# EAGLE board debug_backplane (EAGLE 6.6.0), part 1 of 2
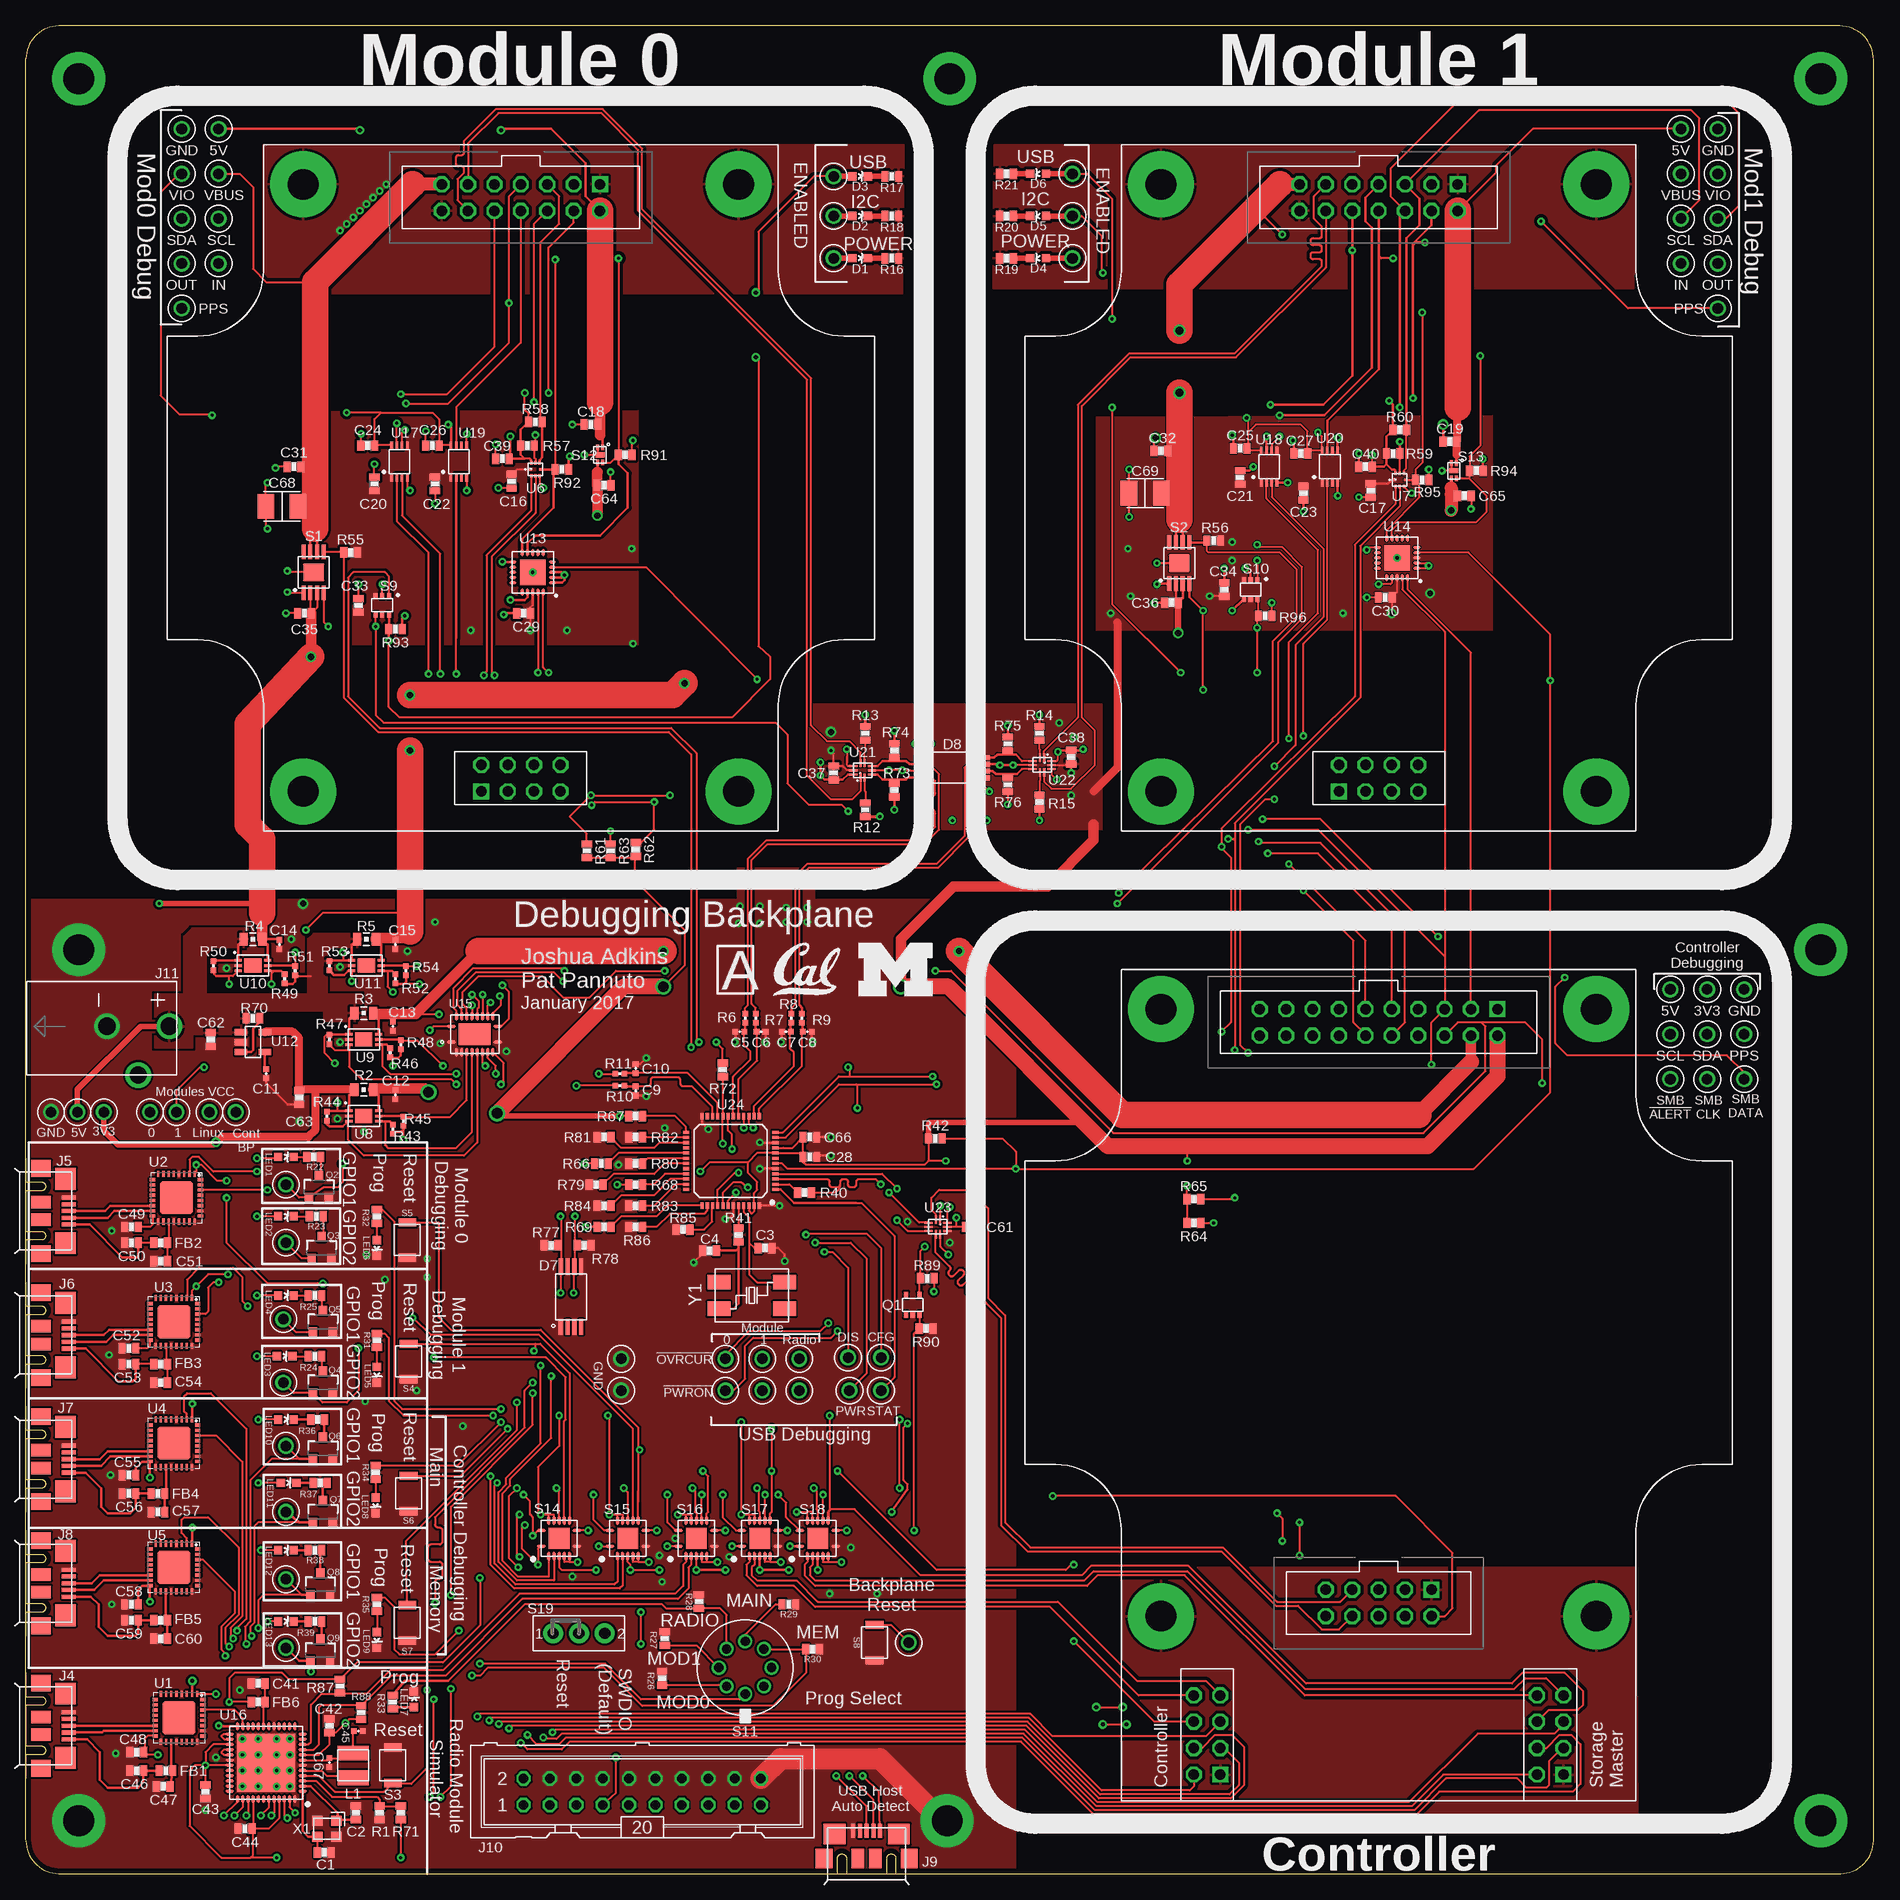
[diagram p15: board, top side]
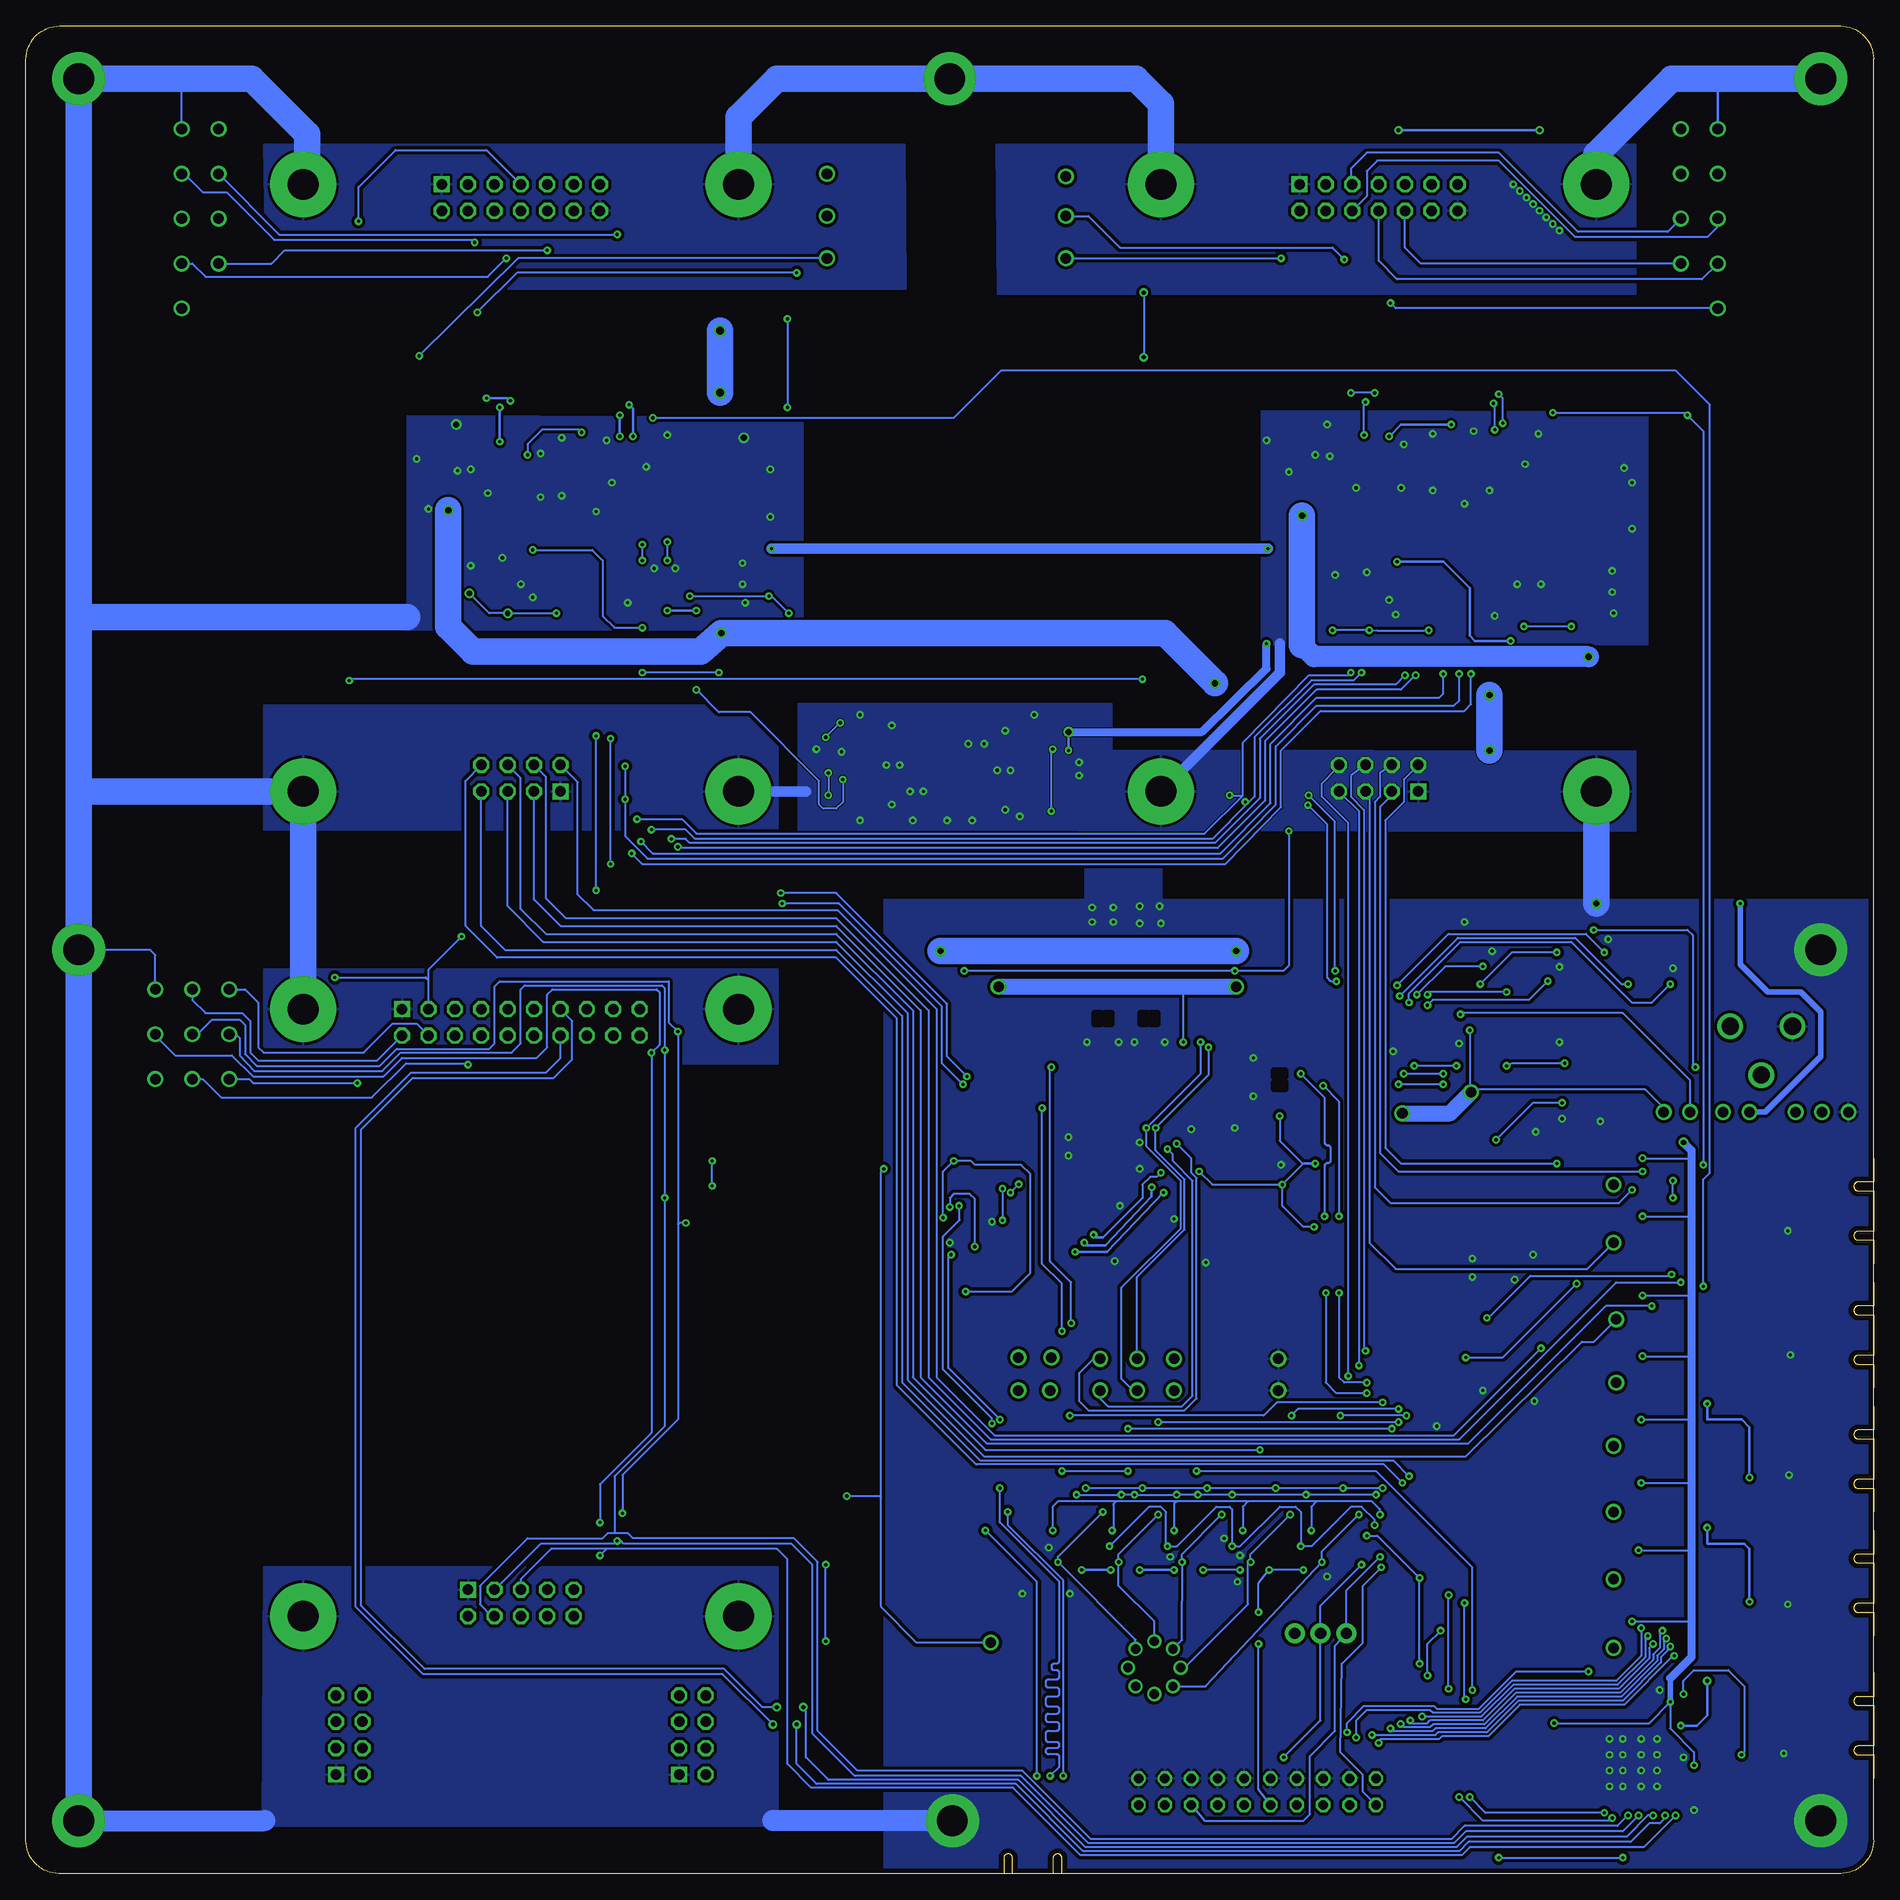
[diagram p16: board, bottom side, seen from below]

Size 177.8 x 177.8 mm. Coordinates in mm from the lower left corner, seen from the top.
Outline: 0,3.17 arc90 3.17,0 174.62,0 arc90 177.8,3.17 177.8,174.56 arc90 174.56,177.8 3.17,177.8 arc90 0,174.62 0,3.24
Copper layers (1*16): Top 0.0178mm / dielectric 59mil / Bottom 0.0178mm
Design rules "quickturn_co_kr_1oz": minimum track width 4mil, minimum drill 0.200659375mm, track to track 4mil, track to pad 4mil, pad to pad 4mil, via to via 4mil, smd to smd 4mil, copper to edge 20mil, drill to drill 16mil, minimum pad ring 8mil, minimum via ring 8mil, stop-mask expansion 3mil, vias tented up to drill 50mil, thermal gap 10mil
tRestrict: area 71.9,69.5 to 72.3,69.6; area 69.8,64.1 to 69.9,64.4

## Footprints (pad centres in the part's own frame; a part is rotated, then mirrored left to right if it is on the bottom)
0603_CAP = smd 0.7 x 1: 1 -0.65,0; 2 0.65,0
0402_CAP = smd 0.536 x 0.546: 1 -0.433,0; 2 0.433,0
1210_CAP = smd 2.4 x 1.6: 1 0,1.55; 2 0,-1.55
LED-0603 = smd 0.8 x 0.8: A 0,-0.75; C 0,0.75
TSSOP-8 = smd 1.5 x 0.45: 1 -2.9,0.975; 2 -2.9,0.325; 3 -2.9,-0.325; 4 -2.9,-0.975; 5 2.9,-0.975; 6 2.9,-0.325; 7 2.9,0.325; 8 2.9,0.975
BACKPLANE_MODULE_20PIN_10PIN_DEBUG = drill 1.016 square: 1 11.43,29.21; 21 5.08,-26.67; 100 -15.24,-44.45; 200 17.78,-44.45 | drill 1.016 octagon: 2 11.43,26.67; 3 8.89,29.21; 4 8.89,26.67; 5 6.35,29.21; 6 6.35,26.67; 7 3.81,29.21; 8 3.81,26.67; 9 1.27,29.21; 10 1.27,26.67; 11 -1.27,29.21; 12 -1.27,26.67; 13 -3.81,29.21; 14 -3.81,26.67; 15 -6.35,29.21; 16 -6.35,26.67; 17 -8.89,29.21; 18 -8.89,26.67; 19 -11.43,29.21; 20 -11.43,26.67; 22 5.08,-29.21; 23 2.54,-26.67; 24 2.54,-29.21; 25 0,-26.67; 26 0,-29.21; 27 -2.54,-26.67; 28 -2.54,-29.21; 29 -5.08,-26.67; 30 -5.08,-29.21; 101 -17.78,-44.45; 102 -15.24,-41.91; 103 -17.78,-41.91; 104 -15.24,-39.37; 105 -17.78,-39.37; 106 -15.24,-36.83; 107 -17.78,-36.83; 201 15.24,-44.45; 202 17.78,-41.91; 203 15.24,-41.91; 204 17.78,-39.37; 205 15.24,-39.37; 206 17.78,-36.83; 207 15.24,-36.83 | drill 2.946 pad 6.35: MNT1 -20.955,29.21; MNT2 20.955,29.21; MNT3 -20.955,-29.21; MNT4 20.955,-29.21
BACKPLANE_MODULE_14PIN_8PIN = drill 1.016 square: 1 7.62,29.21; 15 -3.81,-29.21 | drill 1.016 octagon: 2 7.62,26.67; 3 5.08,29.21; 4 5.08,26.67; 5 2.54,29.21; 6 2.54,26.67; 7 0,29.21; 8 0,26.67; 9 -2.54,29.21; 10 -2.54,26.67; 11 -5.08,29.21; 12 -5.08,26.67; 13 -7.62,29.21; 14 -7.62,26.67; 16 -3.81,-26.67; 17 -1.27,-29.21; 18 -1.27,-26.67; 19 1.27,-29.21; 20 1.27,-26.67; 21 3.81,-29.21; 22 3.81,-26.67 | drill 2.946 pad 6.35: MNT1 -20.955,29.21; MNT2 20.955,29.21; MNT3 20.955,-29.21; MNT4 -20.955,-29.21
USB_MICRO_B-HIROSE-ZX62R-B-5P = smd 0.4 x 1.35: 1 1.3,4.125; 2 0.65,4.125; 3 0,4.125; 4 -0.65,4.125; 5 -1.3,4.125 | smd 2.1 x 2: P$1 3.1,3.8; P$2 -3.1,3.8 | smd 1.6 x 1.9: P$3 -4.1,1.45; P$6 4.1,1.45 | smd 1.2 x 1.9: P$4 -0.85,1.45; P$5 0.85,1.45
ML20 = drill 0.914 octagon: 1 -11.43,-1.27; 2 -11.43,1.27; 3 -8.89,-1.27; 4 -8.89,1.27; 5 -6.35,-1.27; 6 -6.35,1.27; 7 -3.81,-1.27; 8 -3.81,1.27; 9 -1.27,-1.27; 10 -1.27,1.27; 11 1.27,-1.27; 12 1.27,1.27; 13 3.81,-1.27; 14 3.81,1.27; 15 6.35,-1.27; 16 6.35,1.27; 17 8.89,-1.27; 18 8.89,1.27; 19 11.43,-1.27; 20 11.43,1.27
PJ-102AH = drill 1.65: 1 0,-3; 2 0,3; 3 -4.7,0
1212 = smd 1.4 x 3: P$1 -1.2,0; P$2 1.2,0
SOT353 = smd 0.42 x 0.6: D1 0.65,-0.95; D2 -0.65,-0.95; G1 0.65,0.95; G2 -0.65,0.95; S 0,0.95
SOT23-3 = smd 0.8 x 0.9: 1 -0.95,-1; 2 0.95,-1; 3 0,1.1
0603-RES = smd 0.7 x 1: 1 -0.65,0; 2 0.65,0
0805_RES = smd 0.8 x 1.2: 1 -0.9,0; 2 0.9,0
0402_RES-HIGH_SPEED = smd 0.536 x 0.546: 1 -0.433,0; 2 0.433,0
0402_RES = smd 0.536 x 0.546: 1 -0.433,0; 2 0.433,0
MSOP-8EP = smd 0.45 x 1.35: 1 -0.975,-1.975; 2 -0.325,-1.975; 3 0.325,-1.975; 4 0.975,-1.975; 5 0.975,1.975; 6 0.325,1.975; 7 -0.325,1.975; 8 -0.975,1.975 | smd 2 x 1.7: PAD 0,0
B3U-1000P = smd 0.8 x 1.7: 1 -1.7,0; 2 1.7,0
SC70-6 = smd 0.4 x 0.5: 1 -0.65,-0.95; 2 0,-0.95; 3 0.65,-0.95; 4 0.65,0.95; 5 0,0.95; 6 -0.65,0.95
RM-SWITCH = drill 0.9: 1 1.796,1.796; 2 2.54,0; 3 1.796,-1.796; 4 0,-2.54; 5 -1.796,-1.796; 6 -2.54,0; 7 -1.796,1.796; C 0,2.54
TDFN4 = smd 0.3 x 0.55: 1 -0.25,-0.725; 2 0.25,-0.725; 3 0.25,0.725; 4 -0.25,0.725 | smd 0.86 x 0.5: PAD 0,0
S-PVQFN-N14-3.5MM = smd 0.85 x 0.28: 1 -1.725,-0.75; 7 1.725,-0.75; 8 1.725,0.75; 14 -1.725,0.75 | smd 0.28 x 0.85: 2 -1,-1.725; 3 -0.5,-1.725; 4 0,-1.725; 5 0.5,-1.725; 6 1,-1.725; 9 1,1.725; 10 0.5,1.725; 11 0,1.725; 12 -0.5,1.725; 13 -1,1.725 | smd 2 x 2: PAD 0,0
TE_SSA12/SPDT = drill 1.092 pad 1.93: 1 -2.489,0; 2 2.489,0; IN 0,0
TESTPOINT_0.040IN = drill 1.016: TESTPOINT 0,0
QFN32 = smd 0.6 x 0.3: 1 -2.3,1.75; 2 -2.3,1.25; 3 -2.3,0.75; 4 -2.3,0.25; 5 -2.3,-0.25; 6 -2.3,-0.75; 7 -2.3,-1.25; 8 -2.3,-1.75; 17 2.3,-1.75; 18 2.3,-1.25; 19 2.3,-0.75; 20 2.3,-0.25; 21 2.3,0.25; 22 2.3,0.75; 23 2.3,1.25; 24 2.3,1.75 | smd 0.3 x 0.6: 9 -1.75,-2.3; 10 -1.25,-2.3; 11 -0.75,-2.3; 12 -0.25,-2.3; 13 0.25,-2.3; 14 0.75,-2.3; 15 1.25,-2.3; 16 1.75,-2.3; 25 1.75,2.3; 26 1.25,2.3; 27 0.75,2.3; 28 0.25,2.3; 29 -0.25,2.3; 30 -0.75,2.3; 31 -1.25,2.3; 32 -1.75,2.3 | smd 3.2 x 3.2: EXP 0,0
UMLP-8 = smd 0.35 x 0.25: 1 -0.55,0; 5 0.55,0 | smd 0.24 x 0.35: 2 -0.4,-0.625; 3 0,-0.625; 4 0.4,-0.625; 6 0.4,0.625; 7 0,0.625; 8 -0.4,0.625
DFN-6-2MMX3MM = smd 0.25 x 0.7: 1 -0.5,-1.425; 2 0,-1.425; 3 0.5,-1.425; 4 0.5,1.425; 5 0,1.425; 6 -0.5,1.425 | smd 1.35 x 1.65: NC 0,0
SOT-23-5 = smd 0.6 x 1.2: 1 -0.95,-1.15; 2 0,-1.15; 3 0.95,-1.15; 4 0.95,1.15; 5 -0.95,1.15
QFN-20-4MM = smd 0.7 x 0.3: 1 -1.9,1; 2 -1.9,0.5; 3 -1.9,0; 4 -1.9,-0.5; 5 -1.9,-1; 11 1.9,-1; 12 1.9,-0.5; 13 1.9,0; 14 1.9,0.5; 15 1.9,1 | smd 0.3 x 0.7: 6 -1,-1.9; 7 -0.5,-1.9; 8 0,-1.9; 9 0.5,-1.9; 10 1,-1.9; 16 1,1.9; 17 0.5,1.9; 18 0,1.9; 19 -0.5,1.9; 20 -1,1.9 | smd 2.45 x 2.45: GND 0,0
QFN-N20 = smd 0.85 x 0.28: 1 -2.23,-0.75; 10 2.23,-0.75; 11 2.23,0.75; 20 -2.23,0.75 | smd 0.28 x 0.85: 2 -1.75,-1.73; 3 -1.25,-1.73; 4 -0.75,-1.73; 5 -0.25,-1.73; 6 0.25,-1.73; 7 0.75,-1.73; 8 1.25,-1.73; 9 1.75,-1.73; 12 1.75,1.73; 13 1.25,1.73; 14 0.75,1.73; 15 0.25,1.73; 16 -0.25,1.73; 17 -0.75,1.73; 18 -1.25,1.73; 19 -1.75,1.73 | smd 3.05 x 2.05: P$22 0,0
QFN-48-7MM = smd 0.8 x 0.28: 1 -3.5,2.75; 2 -3.5,2.25; 3 -3.5,1.75; 4 -3.5,1.25; 5 -3.5,0.75; 6 -3.5,0.25; 7 -3.5,-0.25; 8 -3.5,-0.75; 9 -3.5,-1.25; 10 -3.5,-1.75; 11 -3.5,-2.25; 12 -3.5,-2.75; 25 3.5,-2.75; 26 3.5,-2.25; 27 3.5,-1.75; 28 3.5,-1.25; 29 3.5,-0.75; 30 3.5,-0.25; 31 3.5,0.25; 32 3.5,0.75; 33 3.5,1.25; 34 3.5,1.75; 35 3.5,2.25; 36 3.5,2.75 | smd 0.28 x 0.8: 13 -2.75,-3.5; 14 -2.25,-3.5; 15 -1.75,-3.5; 16 -1.25,-3.5; 17 -0.75,-3.5; 18 -0.25,-3.5; 19 0.25,-3.5; 20 0.75,-3.5; 21 1.25,-3.5; 22 1.75,-3.5; 23 2.25,-3.5; 24 2.75,-3.5; 37 2.75,3.5; 38 2.25,3.5; 39 1.75,3.5; 40 1.25,3.5; 41 0.75,3.5; 42 0.25,3.5; 43 -0.25,3.5; 44 -0.75,3.5; 45 -1.25,3.5; 46 -1.75,3.5; 47 -2.25,3.5; 48 -2.75,3.5 | smd 5.6 x 5.6: THERMAL 0,0
VFSOP-8 = smd 0.25 x 0.75: 1 -0.75,-1.55; 2 -0.25,-1.55; 3 0.25,-1.55; 4 0.75,-1.55; 5 0.75,1.55; 6 0.25,1.55; 7 -0.25,1.55; 8 -0.75,1.55
UQFN-10 = smd 0.2 x 0.9: 1 -0.2,-0.65 | smd 0.2 x 0.8: 2 0.2,-0.7; 6 0.2,0.7; 7 -0.2,0.7 | smd 0.8 x 0.2: 3 0.9,-0.4; 4 0.9,0; 5 0.9,0.4; 8 -0.9,0.4; 9 -0.9,0; 10 -0.9,-0.4
LQFP-48 = smd 0.3 x 0.6: 1 -2.75,-4.3; 2 -2.25,-4.3; 3 -1.75,-4.3; 4 -1.25,-4.3; 5 -0.75,-4.3; 6 -0.25,-4.3; 7 0.25,-4.3; 8 0.75,-4.3; 9 1.25,-4.3; 10 1.75,-4.3; 11 2.25,-4.3; 12 2.75,-4.3; 25 2.75,4.3; 26 2.25,4.3; 27 1.75,4.3; 28 1.25,4.3; 29 0.75,4.3; 30 0.25,4.3; 31 -0.25,4.3; 32 -0.75,4.3; 33 -1.25,4.3; 34 -1.75,4.3; 35 -2.25,4.3; 36 -2.75,4.3 | smd 0.6 x 0.3: 13 4.3,-2.75; 14 4.3,-2.25; 15 4.3,-1.75; 16 4.3,-1.25; 17 4.3,-0.75; 18 4.3,-0.25; 19 4.3,0.25; 20 4.3,0.75; 21 4.3,1.25; 22 4.3,1.75; 23 4.3,2.25; 24 4.3,2.75; 37 -4.3,2.75; 38 -4.3,2.25; 39 -4.3,1.75; 40 -4.3,1.25; 41 -4.3,0.75; 42 -4.3,0.25; 43 -4.3,-0.25; 44 -4.3,-0.75; 45 -4.3,-1.25; 46 -4.3,-1.75; 47 -4.3,-2.25; 48 -4.3,-2.75
FHXXX = smd 1 x 0.95: 1 -0.925,-0.775; 2 0.925,-0.775; 3 0.925,0.775; 4 -0.925,0.775
ABMM = smd 2.21 x 1.397: 1 -3.167,-1.27; 3 3.15,1.27; NC1 -3.15,1.27; NC2 3.15,-1.27

## Placement (x,y rotation side)
C1  8pF  [0603_CAP]  28.7,2.03 0 top
C2  8pF  [0603_CAP]  31.75,5.84 90 top
C3  22pF  [0603_CAP]  71.12,60.2 180 top
C4  22pF  [0603_CAP]  65.79,59.94 0 top
C5  22pF  [0402_CAP]  68.71,81.03 180 top
C6  22pF  [0402_CAP]  70.74,81.03 0 top
C7  22pF  [0402_CAP]  73.15,81.03 180 top
C8  22pF  [0402_CAP]  75.18,81.03 0 top
C9  22pF  [0402_CAP]  58.67,75.31 270 top
C10  22pF  [0402_CAP]  58.67,77.47 90 top
C11  0.01uF  [0402_CAP]  23.11,76.96 270 top
C12  0.1uF  [0402_CAP]  35.56,74.93 270 top
C13  0.1uF  [0402_CAP]  35.31,81.53 270 top
C14  0.1uF  [0402_CAP]  24.38,89.41 270 top
C15  0.1uF  [0402_CAP]  35.56,89.41 270 top
C16  100nF  [0603_CAP]  46.74,133.99 270 top
C17  100nF  [0603_CAP]  129.41,133.1 270 top
C18  100nF  [0603_CAP]  54.36,139.45 180 top
C19  100nF  [0603_CAP]  137.03,137.79 180 top
C20  100nF  [0603_CAP]  33.53,133.73 90 top
C21  100nF  [0603_CAP]  116.84,134.37 90 top
C22  100nF  [0603_CAP]  39.37,133.73 270 top
C23  100nF  [0603_CAP]  122.94,132.84 270 top
C24  100nF  [0603_CAP]  32.89,137.41 180 top
C25  100nF  [0603_CAP]  116.84,137.16 180 top
C26  100nF  [0603_CAP]  39.12,137.41 180 top
C27  100nF  [0603_CAP]  122.68,136.65 180 top
C28  100nF  [0603_CAP]  75.44,68.96 180 top
C29  100nF  [0603_CAP]  47.88,121.28 180 top
C30  100nF  [0603_CAP]  130.81,122.81 180 top
C31  100nF  [0603_CAP]  25.78,135.38 180 top
C32  100nF  [0603_CAP]  109.22,136.91 180 top
C33  100nF  [0603_CAP]  32,122.05 90 top
C34  100nF  [0603_CAP]  115.32,123.57 90 top
C35  100nF  [0603_CAP]  26.8,121.28 180 top
C36  100nF  [0603_CAP]  110.24,122.3 180 top
C37  100nF  [0603_CAP]  77.72,105.92 90 top
C38  100nF  [0603_CAP]  100.58,107.44 270 top
C39  100nF  [0603_CAP]  45.85,136.14 180 top
C40  100nF  [0603_CAP]  128.91,135.38 180 top
C41  100nF  [0603_CAP]  22.35,18.29 180 top
C42  100nF  [0603_CAP]  29.21,14.22 90 top
C43  100nF  [0603_CAP]  17.27,7.87 270 top
C44  100nF  [0603_CAP]  21.08,4.32 180 top
C45  100nF  [0402_CAP]  32,13.72 0 top
C46  100nF  [0603_CAP]  10.67,9.91 180 top
C47  100nF  [0603_CAP]  13.21,8.38 180 top
C48  100nF  [0603_CAP]  10.67,11.68 180 top
C49  100nF  [0603_CAP]  10.16,62.23 180 top
C50  100nF  [0603_CAP]  10.16,60.71 180 top
C51  100nF  [0603_CAP]  12.95,58.93 180 top
C52  100nF  [0603_CAP]  9.91,50.55 180 top
C53  100nF  [0603_CAP]  9.91,49.02 180 top
C54  100nF  [0603_CAP]  12.95,47.24 180 top
C55  100nF  [0603_CAP]  9.91,38.35 180 top
C56  100nF  [0603_CAP]  9.91,36.58 180 top
C57  100nF  [0603_CAP]  12.7,34.8 180 top
C58  100nF  [0603_CAP]  10.16,25.91 180 top
C59  100nF  [0603_CAP]  10.16,24.38 180 top
C60  100nF  [0603_CAP]  12.95,22.61 180 top
C61  100nF  [0603_CAP]  91.06,62.23 180 top
C62  2.2uF  [0603_CAP]  17.78,80.26 270 top
C63  2.2uF  [0603_CAP]  26.29,74.68 270 top
C64  4.7uF  [0603_CAP]  55.63,133.6 0 top
C65  4.7uF  [0603_CAP]  138.43,132.59 0 top
C66  4.7uF  [0603_CAP]  75.44,70.87 180 top
C67  4.7uF  [0402_CAP]  29.21,10.67 270 top
C68  150uF  [1210_CAP]  24.64,131.57 270 top
C69  150uF  [1210_CAP]  107.7,132.84 270 top
D1  LED0603  [LED-0603]  80.26,155.45 270 top
D2  LED0603  [LED-0603]  80.26,159.51 270 top
D3  LED0603  [LED-0603]  80.26,163.32 270 top
D4  LED0603  [LED-0603]  97.41,155.45 90 top
D5  LED0603  [LED-0603]  97.41,159.51 90 top
D6  LED0603  [LED-0603]  97.41,163.58 90 top
D7  SN75240-TSSOP  [TSSOP-8]  52.45,55.5 90 top
D8  SN75240-TSSOP  [TSSOP-8]  89.15,106.43 0 top
FB1  600R  [0603_CAP]  13.46,9.91 180 top
FB2  600R  [0603_CAP]  12.95,60.71 0 top
FB3  600R  [0603_CAP]  12.95,49.02 0 top
FB4  600R  [0603_CAP]  12.7,36.58 0 top
FB5  600R  [0603_CAP]  12.95,24.38 0 top
FB6  1.5kR  [0603_CAP]  22.35,16.51 180 top
J1  BACKPLANE_CONTROLLER_MODULE_DEBUG  [BACKPLANE_MODULE_20PIN_10PIN_DEBUG]  130.18,53.98 0 top
J2  BACKPLANE_GENERIC_MODULE_DEBUG  [BACKPLANE_MODULE_14PIN_8PIN]  130.18,133.35 0 top
J3  BACKPLANE_GENERIC_MODULE_DEBUG  [BACKPLANE_MODULE_14PIN_8PIN]  47.62,133.35 0 top
J4  MICRO_USB_B_HIROSE_ZX62R-B-5P  [USB_MICRO_B-HIROSE-ZX62R-B-5P]  0,14.22 270 top
J5  MICRO_USB_B_HIROSE_ZX62R-B-5P  [USB_MICRO_B-HIROSE-ZX62R-B-5P]  0,63.75 270 top
J6  MICRO_USB_B_HIROSE_ZX62R-B-5P  [USB_MICRO_B-HIROSE-ZX62R-B-5P]  0,51.82 270 top
J7  MICRO_USB_B_HIROSE_ZX62R-B-5P  [USB_MICRO_B-HIROSE-ZX62R-B-5P]  0,39.88 270 top
J8  MICRO_USB_B_HIROSE_ZX62R-B-5P  [USB_MICRO_B-HIROSE-ZX62R-B-5P]  0,27.94 270 top
J9  MICRO_USB_B_HIROSE_ZX62R-B-5P  [USB_MICRO_B-HIROSE-ZX62R-B-5P]  80.9,0 0 top
J10  [ML20]  59.31,7.87 0 top
J11  PJ-102AH  [PJ-102AH]  10.79,81.53 90 top
L1  22uH  [1212]  31.5,10.41 270 top
LED1  LED0603  [LED-0603]  25.02,68.96 270 top
LED2  LED0603  [LED-0603]  25.02,63.25 270 top
LED3  LED0603  [LED-0603]  24.89,49.78 270 top
LED4  LED0603  [LED-0603]  25.02,55.63 270 top
LED5  LED0603  [LED-0603]  33.78,48.01 180 top
LED6  LED0603  [LED-0603]  33.78,60.2 180 top
LED7  LED0603  [LED-0603]  37.34,16.76 0 top
LED8  LED0603  [LED-0603]  33.66,35.43 180 top
LED9  LED0603  [LED-0603]  33.78,22.48 180 top
LED10  LED0603  [LED-0603]  25.02,43.69 270 top
LED11  LED0603  [LED-0603]  25.27,37.59 270 top
LED12  LED0603  [LED-0603]  25.02,31.11 270 top
LED13  LED0603  [LED-0603]  25.02,24.26 270 top
Q1  DMN32D2LDF  [SOT353]  85.34,54.74 180 top
Q2  MOSFET-NCHANNELSMD  [SOT23-3]  28.19,66.04 0 top
Q3  MOSFET-NCHANNELSMD  [SOT23-3]  28.45,60.2 0 top
Q4  MOSFET-NCHANNELSMD  [SOT23-3]  28.57,47.24 0 top
Q5  MOSFET-NCHANNELSMD  [SOT23-3]  28.57,53.09 0 top
Q6  MOSFET-NCHANNELSMD  [SOT23-3]  28.57,40.89 0 top
Q7  MOSFET-NCHANNELSMD  [SOT23-3]  28.57,34.8 0 top
Q8  MOSFET-NCHANNELSMD  [SOT23-3]  28.32,27.81 0 top
Q9  MOSFET-NCHANNELSMD  [SOT23-3]  28.32,21.46 0 top
R1  0Ω  [0603-RES]  34.04,5.84 90 top
R2  0.017Ω  [0805_RES]  32.51,75.44 180 top
R3  0.017Ω  [0805_RES]  32.51,82.8 180 top
R4  0.017Ω  [0805_RES]  21.84,89.92 180 top
R5  0.017Ω  [0805_RES]  32.77,89.92 180 top
R6  27Ω  [0402_RES-HIGH_SPEED]  69.22,82.3 270 top
R7  27Ω  [0402_RES-HIGH_SPEED]  70.23,82.3 270 top
R8  27Ω  [0402_RES-HIGH_SPEED]  73.66,82.3 270 top
R9  27Ω  [0402_RES-HIGH_SPEED]  74.68,82.3 270 top
R10  27Ω  [0402_RES-HIGH_SPEED]  57.15,75.82 0 top
R11  27Ω  [0402_RES-HIGH_SPEED]  57.15,76.96 0 top
R12  50Ω  [0603-RES]  80.77,102.36 270 top
R13  50Ω  [0603-RES]  80.77,109.73 90 top
R14  50Ω  [0603-RES]  97.54,109.73 90 top
R15  50Ω  [0603-RES]  97.54,103.12 270 top
R16  1kΩ  [0603-RES]  83.31,155.45 180 top
R17  1kΩ  [0603-RES]  83.31,163.32 180 top
R18  1kΩ  [0603-RES]  83.31,159.51 180 top
R19  1kΩ  [0603-RES]  94.36,155.45 0 top
R20  1kΩ  [0603-RES]  94.36,159.51 0 top
R21  1kΩ  [0603-RES]  94.36,163.58 0 top
R22  1kΩ  [0603-RES]  27.69,68.96 180 top
R23  1kΩ  [0603-RES]  27.94,63.25 180 top
R24  1kΩ  [0603-RES]  27.81,49.78 180 top
R25  1kΩ  [0603-RES]  27.81,55.63 180 top
R26  1kΩ  [0603-RES]  61.21,18.8 270 top
R27  1kΩ  [0603-RES]  61.47,22.61 270 top
R28  1kΩ  [0603-RES]  64.77,26.16 270 top
R29  1kΩ  [0603-RES]  73.41,25.91 180 top
R30  1kΩ  [0603-RES]  75.69,21.59 180 top
R31  1kΩ  [0603-RES]  33.78,51.31 90 top
R32  1kΩ  [0603-RES]  33.78,63.25 90 top
R33  1kΩ  [0603-RES]  35.31,16.51 90 top
R34  1kΩ  [0603-RES]  33.66,38.61 90 top
R35  1kΩ  [0603-RES]  33.78,25.91 90 top
R36  1kΩ  [0603-RES]  28.07,43.69 180 top
R37  1kΩ  [0603-RES]  28.32,37.59 180 top
R38  1kΩ  [0603-RES]  27.81,31.11 180 top
R39  1kΩ  [0603-RES]  27.81,24.26 180 top
R40  1.5kΩ  [0603-RES]  74.93,65.53 180 top
R41  1.5kΩ  [0603-RES]  68.58,61.47 90 top
R42  1.5kΩ  [0603-RES]  87.5,70.74 0 top
R43  2kΩ  [0402_RES]  35.31,71.63 270 top
R44  2kΩ  [0402_RES]  28.96,72.9 90 top
R45  2kΩ  [0402_RES]  36.32,72.39 270 top
R46  2kΩ  [0402_RES]  35.05,78.99 270 top
R47  2kΩ  [0402_RES]  29.21,80.26 90 top
R48  2kΩ  [0402_RES]  36.07,79.76 270 top
R49  2kΩ  [0402_RES]  24.89,86.11 270 top
R50  2kΩ  [0402_RES]  18.03,87.38 90 top
R51  2kΩ  [0402_RES]  25.91,86.87 270 top
R52  2kΩ  [0402_RES]  35.56,86.11 270 top
R53  2kΩ  [0402_RES]  29.21,87.38 90 top
R54  2kΩ  [0402_RES]  36.58,86.87 270 top
R55  10kΩ  [0603-RES]  31.24,127.13 0 top
R56  10kΩ  [0603-RES]  114.3,128.27 0 top
R57  10kΩ  [0603-RES]  48.26,137.41 0 top
R58  10kΩ  [0603-RES]  49.02,139.7 0 top
R59  10kΩ  [0603-RES]  131.57,136.65 0 top
R60  10kΩ  [0603-RES]  132.21,138.94 0 top
R61  10kΩ  [0603-RES]  53.98,98.42 270 top
R62  10kΩ  [0603-RES]  58.67,98.55 270 top
R63  10kΩ  [0603-RES]  56.26,98.42 270 top
R64  10kΩ  [0603-RES]  112.39,62.61 180 top
R65  10kΩ  [0603-RES]  112.39,64.9 180 top
R66  10kΩ  [0603-RES]  55.37,68.33 180 top
R67  10kΩ  [0603-RES]  58.67,72.9 180 top
R68  10kΩ  [0603-RES]  58.67,66.29 180 top
R69  10kΩ  [0603-RES]  55.63,62.23 180 top
R70  10kΩ  [0603-RES]  21.84,82.3 180 top
R71  10kΩ  [0603-RES]  36.07,5.84 270 top
R72  10kΩ  [0603-RES]  67.06,77.34 90 top
R73  15kΩ  [0603-RES]  83.57,104.27 90 top
R74  15kΩ  [0603-RES]  83.57,108.08 270 top
R75  15kΩ  [0603-RES]  94.49,108.71 270 top
R76  15kΩ  [0603-RES]  94.49,104.78 90 top
R77  15kΩ  [0603-RES]  50.55,60.45 0 top
R78  15kΩ  [0603-RES]  53.72,60.45 180 top
R79  15kΩ  [0603-RES]  54.86,66.29 180 top
R80  15kΩ  [0603-RES]  58.67,68.33 180 top
R81  15kΩ  [0603-RES]  55.63,70.87 180 top
R82  15kΩ  [0603-RES]  58.67,70.87 180 top
R83  15kΩ  [0603-RES]  58.67,64.26 180 top
R84  15kΩ  [0603-RES]  55.63,64.26 180 top
R85  15kΩ  [0603-RES]  63.25,61.98 180 top
R86  15kΩ  [0603-RES]  58.67,62.23 180 top
R87  100kΩ  [0603-RES]  30.23,18.03 90 top
R88  100kΩ  [0603-RES]  32.26,15.49 270 top
R89  100kΩ  [0603-RES]  86.74,57.28 0 top
R90  100kΩ  [0603-RES]  86.61,52.45 180 top
R91  10MΩ  [0603-RES]  57.66,136.53 180 top
R92  10MΩ  [0603-RES]  51.56,135.13 180 top
R93  10MΩ  [0603-RES]  35.56,119.76 180 top
R94  10MΩ  [0603-RES]  139.57,135 180 top
R95  10MΩ  [0603-RES]  134.37,134.11 180 top
R96  10MΩ  [0603-RES]  119.25,121.03 180 top
S1  AP2401MP  [MSOP-8EP]  27.69,125.22 0 top
S2  AP2401MP  [MSOP-8EP]  111,126.11 0 top
S3  B3U-1000P  [B3U-1000P]  35.31,10.41 270 top
S4  B3U-1000P  [B3U-1000P]  36.83,49.28 90 top
S5  B3U-1000P  [B3U-1000P]  36.7,60.96 90 top
S6  B3U-1000P  [B3U-1000P]  36.83,36.58 90 top
S7  B3U-1000P  [B3U-1000P]  36.7,24.13 90 top
S8  B3U-1000P  [B3U-1000P]  81.66,22.23 90 top
S9  NC7SZ157  [SC70-6]  34.29,122.05 180 top
S10  NC7SZ157  [SC70-6]  117.86,123.57 180 top
S11  RM106772BCB  [RM-SWITCH]  69.22,19.81 180 top
S12  SIP3240X  [TDFN4]  55.24,136.53 180 top
S13  SIP3240X  [TDFN4]  137.41,135 180 top
S14  SN74AHC4066-RGY  [S-PVQFN-N14-3.5MM]  51.31,32.26 0 top
S15  SN74AHC4066-RGY  [S-PVQFN-N14-3.5MM]  57.91,32.26 0 top
S16  SN74AHC4066-RGY  [S-PVQFN-N14-3.5MM]  64.52,32.26 0 top
S17  SN74AHC4066-RGY  [S-PVQFN-N14-3.5MM]  70.61,32.26 0 top
S18  SN74AHC4066-RGY  [S-PVQFN-N14-3.5MM]  76.2,32.26 0 top
S19  TE_SSA12/SPDT  [TE_SSA12/SPDT]  53.21,23.11 0 top
TP1  TEST_POINT_0.040IN  [TESTPOINT_0.040IN]  165.35,76.45 0 top
TP2  TEST_POINT_0.040IN  [TESTPOINT_0.040IN]  161.8,76.45 0 top
TP3  TEST_POINT_0.040IN  [TESTPOINT_0.040IN]  158.24,76.45 0 top
TP4  TEST_POINT_0.040IN  [TESTPOINT_0.040IN]  4.95,73.28 0 top
TP5  TEST_POINT_0.040IN  [TESTPOINT_0.040IN]  161.8,80.77 0 top
TP6  TEST_POINT_0.040IN  [TESTPOINT_0.040IN]  158.24,80.77 0 top
TP7  TEST_POINT_0.040IN  [TESTPOINT_0.040IN]  7.49,73.28 0 top
TP8  TEST_POINT_0.040IN  [TESTPOINT_0.040IN]  20.19,73.28 0 top
TP9  TEST_POINT_0.040IN  [TESTPOINT_0.040IN]  84.96,22.23 0 top
TP10  TEST_POINT_0.040IN  [TESTPOINT_0.040IN]  165.35,80.77 0 top
TP11  TEST_POINT_0.040IN  [TESTPOINT_0.040IN]  165.35,85.09 0 top
TP12  TEST_POINT_0.040IN  [TESTPOINT_0.040IN]  25.02,41.15 0 top
TP13  TEST_POINT_0.040IN  [TESTPOINT_0.040IN]  25.02,34.8 0 top
TP14  TEST_POINT_0.040IN  [TESTPOINT_0.040IN]  25.02,28.32 0 top
TP15  TEST_POINT_0.040IN  [TESTPOINT_0.040IN]  25.02,21.72 0 top
TP16  TEST_POINT_0.040IN  [TESTPOINT_0.040IN]  11.94,73.28 0 top
TP17  TEST_POINT_0.040IN  [TESTPOINT_0.040IN]  14.48,73.28 0 top
TP18  TEST_POINT_0.040IN  [TESTPOINT_0.040IN]  17.65,73.28 0 top
TP20  TEST_POINT_0.040IN  [TESTPOINT_0.040IN]  18.54,163.58 0 top
TP21  TEST_POINT_0.040IN  [TESTPOINT_0.040IN]  25.02,66.29 0 top
TP23  TEST_POINT_0.040IN  [TESTPOINT_0.040IN]  158.24,85.09 0 top
TP24  TEST_POINT_0.040IN  [TESTPOINT_0.040IN]  161.8,85.09 0 top
TP25  TEST_POINT_0.040IN  [TESTPOINT_0.040IN]  57.28,49.53 0 top
TP27  TEST_POINT_0.040IN  [TESTPOINT_0.040IN]  162.81,167.89 0 top
TP28  TEST_POINT_0.040IN  [TESTPOINT_0.040IN]  82.3,49.66 0 top
TP29  TEST_POINT_0.040IN  [TESTPOINT_0.040IN]  79.25,46.48 0 top
TP30  TEST_POINT_0.040IN  [TESTPOINT_0.040IN]  79.12,49.66 0 top
TP31  TEST_POINT_0.040IN  [TESTPOINT_0.040IN]  82.3,46.48 0 top
TP32  TEST_POINT_0.040IN  [TESTPOINT_0.040IN]  67.31,46.48 0 top
TP33  TEST_POINT_0.040IN  [TESTPOINT_0.040IN]  67.31,49.53 0 top
TP34  TEST_POINT_0.040IN  [TESTPOINT_0.040IN]  70.87,46.48 0 top
TP35  TEST_POINT_0.040IN  [TESTPOINT_0.040IN]  70.87,49.53 0 top
TP36  TEST_POINT_0.040IN  [TESTPOINT_0.040IN]  74.42,46.48 180 top
TP37  TEST_POINT_0.040IN  [TESTPOINT_0.040IN]  74.42,49.53 0 top
TP38  TEST_POINT_0.040IN  [TESTPOINT_0.040IN]  25.02,60.71 0 top
TP39  TEST_POINT_0.040IN  [TESTPOINT_0.040IN]  24.77,47.24 0 top
TP40  TEST_POINT_0.040IN  [TESTPOINT_0.040IN]  24.77,53.34 0 top
TP41  TEST_POINT_0.040IN  [TESTPOINT_0.040IN]  159.26,163.58 0 top
TP42  TEST_POINT_0.040IN  [TESTPOINT_0.040IN]  14.99,159.26 0 top
TP43  TEST_POINT_0.040IN  [TESTPOINT_0.040IN]  18.54,159.26 0 top
TP44  TEST_POINT_0.040IN  [TESTPOINT_0.040IN]  162.81,159.26 0 top
TP45  TEST_POINT_0.040IN  [TESTPOINT_0.040IN]  159.26,159.26 0 top
TP46  TEST_POINT_0.040IN  [TESTPOINT_0.040IN]  14.99,150.62 0 top
TP47  TEST_POINT_0.040IN  [TESTPOINT_0.040IN]  162.81,150.62 0 top
TP48  TEST_POINT_0.040IN  [TESTPOINT_0.040IN]  18.54,154.94 0 top
TP49  TEST_POINT_0.040IN  [TESTPOINT_0.040IN]  14.99,154.94 0 top
TP50  TEST_POINT_0.040IN  [TESTPOINT_0.040IN]  14.99,163.58 0 top
TP51  TEST_POINT_0.040IN  [TESTPOINT_0.040IN]  57.28,46.48 0 top
TP52  TEST_POINT_0.040IN  [TESTPOINT_0.040IN]  159.26,154.94 0 top
TP53  TEST_POINT_0.040IN  [TESTPOINT_0.040IN]  162.81,154.94 0 top
TP54  TEST_POINT_0.040IN  [TESTPOINT_0.040IN]  14.99,167.89 0 top
TP55  TEST_POINT_0.040IN  [TESTPOINT_0.040IN]  162.81,163.58 0 top
TP56  TEST_POINT_0.040IN  [TESTPOINT_0.040IN]  2.41,73.28 0 top
TP57  TEST_POINT_0.040IN  [TESTPOINT_0.040IN]  18.54,167.89 0 top
TP58  TEST_POINT_0.040IN  [TESTPOINT_0.040IN]  159.26,167.89 0 top
TP1001  TEST_POINT_0.040IN  [TESTPOINT_0.040IN]  77.72,155.45 0 top
TP1002  TEST_POINT_0.040IN  [TESTPOINT_0.040IN]  77.72,159.51 0 top
TP1003  TEST_POINT_0.040IN  [TESTPOINT_0.040IN]  77.72,163.32 0 top
TP1004  TEST_POINT_0.040IN  [TESTPOINT_0.040IN]  100.71,155.45 90 top
TP1005  TEST_POINT_0.040IN  [TESTPOINT_0.040IN]  100.71,159.51 90 top
TP1006  TEST_POINT_0.040IN  [TESTPOINT_0.040IN]  100.71,163.58 90 top
U1  FT232RQ  [QFN32]  14.73,14.99 270 top
U2  FT232RQ  [QFN32]  14.48,65.02 270 top
U3  FT232RQ  [QFN32]  14.22,53.09 270 top
U4  FT232RQ  [QFN32]  14.22,41.4 270 top
U5  FT232RQ  [QFN32]  14.22,29.46 270 top
U6  FXMA2102  [UMLP-8]  49.02,135.13 0 top
U7  FXMA2102  [UMLP-8]  132.21,134.11 0 top
U8  LTC2941  [DFN-6-2MMX3MM]  32.51,72.9 270 top
U9  LTC2941  [DFN-6-2MMX3MM]  32.51,80.26 270 top
U10  LTC2941  [DFN-6-2MMX3MM]  21.84,87.38 270 top
U11  LTC2941  [DFN-6-2MMX3MM]  32.77,87.38 270 top
U12  MAX8887EZK33+T  [SOT-23-5]  21.84,80.01 270 top
U13  MCP23008QFN  [QFN-20-4MM]  48.77,125.22 180 top
U14  MCP23008QFN  [QFN-20-4MM]  131.95,126.62 180 top
U15  PCA9544AQFN-N20  [QFN-N20]  43.18,80.77 0 top
U16  SAM4LC8AA  [QFN-48-7MM]  23.11,10.67 180 top
U17  SN74LVC2T45  [VFSOP-8]  35.94,135.89 0 top
U18  SN74LVC2T45  [VFSOP-8]  119.63,135.38 0 top
U19  SN74LVC2T45  [VFSOP-8]  41.66,135.89 0 top
U20  SN74LVC2T45  [VFSOP-8]  125.48,135.38 0 top
U21  TS3USB30E  [UQFN-10]  80.52,106.17 0 top
U22  TS3USB30E  [UQFN-10]  97.79,106.68 180 top
U23  TS3USB30E  [UQFN-10]  87.76,62.23 180 top
U24  TUSB2077A  [LQFP-48]  67.82,68.58 90 top
U$12  [UMICH_SOLID_200MIL]  80.14,84.45 0 top
U$15  [UCB_CAL_200MIL]  71.88,84.45 0 top
X1  16MHz  [FHXXX]  28.96,4.32 180 top
Y1  ABMM  [ABMM]  69.85,55.63 0 top

## Tracks (layer width: path | path; a pad name or v marks a point on that pad's centre or on a via)
3V3  (via drill 0.3, 0.51)
  Top 0.203: U16.40 21.86,4.45 C44.1 | 19.59,12.45 U16.27 18.06,12.42 18.03,12.45 17.27,11.68 v17.27,10.41 | FB6.2 v19.56,16.51 19.56,18.8 20.07,19.3 24.64,19.3 25.26,18.68 R87.2 31.86,20.32 40.13,20.32 43.69,23.88 v43.69,28.45 | U16.8 28.18,11.42 29.21,12.45 C42.1 29.83,13.57 v30.73,14.48 31.1,14.84 R88.2 | U16.45 24.36,5.31 23.37,4.32 C44.1 | LED1.A 24.13,68.83 v22.23,68.83 | LED2.A v22.23,63.25 | LED4.A v22.23,55.63 | LED3.A v22.23,49.78 | LED10.A v22.35,43.69 | LED11.A v22.35,37.59 | LED12.A v22.61,31.11 | LED13.A v23.24,24.26 | 21.59,1.52 18.8,1.52 15.75,4.57 15.75,9.91 16.26,10.41 v17.27,10.41 | 21.59,1.52 21.84,1.78 21.84,4.21 C44.1 | R71.2 v36.07,1.52 | v24.13,1.52 21.59,1.52 | U8.1 29.98,73.4 29.97,73.41 v29.97,74.17 | v36.32,70.61 R45.2 | U16.31 v17.27,10.41 | C43.1 v17.27,10.41 | S14.14 49.26,33.01 v48.77,32.51 48.77,34.29 48.51,34.54 48.51,35.81 v47.88,36.45 | S18.14 74.43,33.01 73.15,34.29 73.15,35.69 v72.39,36.45 | v67.06,36.45 67.06,34.29 68.33,33.02 68.88,33.02 S17.14 | S16.14 62.5,33.01 61.72,33.78 v61.72,36.45 | S15.14 55.64,33.01 54.61,34.04 v54.61,36.45 | v43.69,20.19 55.75,20.19 59.18,16.76 68.71,16.76 S11.C | S16.10 65.02,34.92 65.02,35.18 v65.02,36.45 | S17.10 71.11,35.3 71.12,35.31 v71.12,36.45 | S18.10 v76.7,36.44 v76.71,36.45
  Top 0.254: R44.2 29.02,73.4 U8.1 31.09,74.91 R2.2 | R45.2 36.32,71.63 36.07,71.37 35.38,71.37 R43.2
  Top 0.508: TP7.TESTPOINT 7.49,71.5 8.89,70.1 18.03,70.1 v18.29,70.36
  Top 0.762: R2.2 27.81,75.44 | 27.81,75.44 26.53,75.44 C63.1 26.29,80.39 25.65,81.03 23.06,81.03 U12.5 | 27.81,75.44 27.81,71.5 27.18,70.87 18.8,70.87 v18.29,70.36
  Bottom 0.203: v22.23,68.83 17.78,68.83 17.53,69.09 | v22.23,63.25 17.78,63.25 17.53,63.5 | v22.23,55.63 17.78,55.63 17.53,55.37 | v22.23,49.78 17.53,49.78 | v22.35,43.69 17.53,43.69 | v22.35,37.59 17.53,37.59 | v22.61,31.11 17.53,31.11 | v23.24,24.26 17.78,24.26 17.53,24.64 | v36.07,1.52 v24.13,1.52 | v30.73,14.48 21.59,14.48 v19.56,16.51 19.56,13.97 17.27,11.68 v17.27,10.41 | v29.97,74.17 32.77,74.17 v36.32,70.61 | v48.77,32.51 47.75,32.51 v43.69,28.45 v43.69,20.19 | v47.88,36.45 v54.61,36.45 v61.72,36.45 v65.02,36.45 v67.06,36.45 v71.12,36.45 v72.39,36.45 v76.71,36.45
  Bottom 0.508: v19.56,16.51 19.56,18.8
  Bottom 0.762: v18.29,70.36 17.53,69.6 17.53,69.09 17.53,63.5 17.53,55.37 17.53,49.78 17.53,43.69 17.53,37.59 17.53,31.11 17.53,24.64 17.53,20.83 19.56,18.8
5V  (via drill 0.3)
  Top 0.203: 29.53,80.76 28.95,80.76 28.7,80.52 28.7,78.99 v29.72,77.98 | v35.31,77.72 35.31,78.31 R46.2 | 30.57,87.88 30.57,88.56 v30.48,88.65 | v37.85,85.6 36.07,85.6 | R51.2 25.98,86.36 27.43,86.36
  Top 0.254: R47.2 29.53,80.76 U9.1 31.09,82.28 R3.2 | R48.2 36.07,78.74 35.81,78.49 35.13,78.49 R46.2 | R50.2 18.36,87.88 U10.1 20.42,89.39 R4.2 | R51.2 25.91,85.85 25.65,85.6 24.97,85.6 R49.2 | R53.2 29.4,87.88 30.57,87.88 U11.1 31.34,89.39 R5.2 | R54.2 36.58,85.85 36.32,85.6 36.07,85.6 35.63,85.6 R52.2
  Top 0.508: TP4.TESTPOINT 4.95,75.44 11.05,81.53 J11.1
  Bottom 0.203: v29.72,77.98 34.8,77.98 v35.31,77.72 | v30.48,88.65 34.8,88.65 v37.85,85.6
  pour Top (isolate 0.305): 12.45,79.5 12.45,84.58 21.34,84.58 21.34,80.77 16,80.77 16,79.5
  pour Top (isolate 0.305): 21.34,89.15 18.03,89.15 17.27,88.39 17.27,82.3 15.24,82.3 15.24,90.17 16,90.93 21.34,90.93 21.34,89.41
  pour Top (isolate 0.305): 32.26,89.15 29.46,89.15 28.96,88.65 28.96,83.06 20.83,83.06 20.83,84.58 27.18,84.58 27.18,89.92 27.69,90.42 32.26,90.42
  pour Top (isolate 0.305): 28.7,84.58 32.26,84.58 32.26,82.04 28.7,82.04
!BACKPLANE_RESET  (via drill 0.3)
  Top 0.203: J1.22 136.53,24.77 137.29,25.53 137.29,30.86 131.83,36.32 v98.81,36.32 | v95.25,67.82 73.28,67.82 72.77,68.33 U24.6 | v95.25,67.82 139.32,67.82 146.69,75.18 v146.69,114.81 146.69,119.25 138.81,127.13 U14.4 | U13.4 59.7,125.72 v70.36,114.94 | R42.2 93.98,70.74 95.25,69.47 v95.25,67.82 | S8.2 83.26,23.93 TP9.TESTPOINT
  Bottom 0.203: v70.36,114.94 146.43,114.94 v146.69,114.81 | TP9.TESTPOINT 92.08,22.23 95.5,25.65 95.5,36.32 | 95.5,36.32 95.5,67.56 v95.25,67.82 | v98.81,36.32 95.5,36.32
!SMBALERT  (via drill 0.3)
  Top 0.203: U15.17 42.43,83.3 42.04,83.69 42.04,84.84 43.56,86.36 49.66,86.36 51.69,84.33 54.23,84.33 56.77,86.87 v61.47,86.87 | v87.5,86.87 89.03,86.87 104.65,71.25 134.49,71.25 140.46,77.22 140.46,81.53 140.08,81.92 | 140.08,81.92 137.79,81.92 J1.6 | R63.1 v56.26,100.33 | v145.92,76.07 145.92,80.26 144.27,81.92 140.08,81.92
  Bottom 0.203: v87.5,86.87 v61.47,86.87 56.77,86.87 56.26,87.38 v56.26,100.33 | TP3.TESTPOINT 156.34,76.45 155.96,76.07 v145.92,76.07
CONT0_!RESET  (via drill 0.3)
  Top 0.203: J1.105 108.58,14.61 v100.84,22.35 | v100.84,29.72 100.58,29.72 100.08,29.21 87.63,29.21 v78.11,38.73 | S6.2 41.83,38.28 v46.35,42.8 | v71.75,42.8 v71.75,38.73 71.75,34.8 71.61,34.66 S17.9
  Bottom 0.203: v100.84,22.35 v100.84,29.72 | v46.35,42.8 v71.75,42.8 | v78.11,38.73 v71.75,38.73
CONT0_DBG_GPIO1  (via drill 0.3)
  Top 0.203: Q6.1 23.64,39.89 21.59,37.85 21.59,24.26 21.08,23.75 21.08,22.23 v21.21,22.1 | J1.101 112.39,8.38 112.01,8 103.5,8 96.52,14.99 44.83,14.99 v44.58,14.73
  Top 0.254: TP12.TESTPOINT 26.27,39.89 Q6.1
  Bottom 0.203: v21.21,22.1 21.59,21.72 21.59,20.7 24.51,17.78 34.54,17.78 37.59,14.73 42.67,14.73 42.93,14.48 44.32,14.48 v44.58,14.73
CONT0_DBG_GPIO2  (via drill 0.3)
  Top 0.203: J1.104 113.54,13.21 98.81,13.21 96.65,15.37 43.69,15.37 v43.43,15.11 | Q7.1 22.37,33.8 21.97,33.4 21.97,24.13 21.59,23.75 21.59,22.99 v21.72,22.86
  Top 0.254: Q7.1 26.27,33.8 TP13.TESTPOINT
  Bottom 0.203: v21.72,22.86 21.97,22.61 21.97,20.83 24.64,18.16 34.67,18.16 37.72,15.11 v43.43,15.11
CONT0_DBG_RX  (via drill 0.3)
  Top 0.203: U4.30 16.75,42.15 16.76,42.16 18.29,42.16 20.83,39.62 20.83,24.77 19.68,23.62 19.68,22.86 v19.94,22.61 | J1.103 113.16,12.06 114.43,13.34 116.08,13.34 117.22,12.19 117.22,8.51 115.95,7.24 103.25,7.24 96.27,14.22 46.74,14.22 v46.48,13.97
  Bottom 0.203: v19.94,22.61 20.19,22.35 20.19,21.59 20.83,20.95 20.83,20.45 24.26,17.02 34.29,17.02 37.34,13.97 42.16,13.97 42.42,13.72 46.23,13.72 v46.48,13.97
CONT0_DBG_TX  (via drill 0.3)
  Top 0.203: U4.2 15.47,44.22 15.24,44.45 15.24,45.97 15.49,46.23 17.78,46.23 21.21,42.8 21.21,24.51 20.32,23.62 v20.32,23.37 | J1.102 115.32,12.06 116.71,10.67 116.71,8.51 115.82,7.62 103.38,7.62 96.39,14.61 45.72,14.61 v45.52,14.4
  Bottom 0.203: v20.32,23.37 20.57,23.11 20.57,21.72 21.21,21.08 21.21,20.57 24.38,17.4 34.42,17.4 37.47,14.35 42.42,14.35 42.67,14.1 45.21,14.1 v45.52,14.4
CONT0_SWDCLK
  Top 0.203: S17.3 70.11,29.73 69.85,29.46 69.85,28.7 70.36,28.19 74.17,28.19 76.2,26.16 99.31,26.16 106.93,18.54 113.54,18.54 J1.106
CONT0_SWDIO
  Top 0.203: S17.2 69.61,29.99 69.34,29.72 69.34,28.7 70.36,27.69 73.91,27.69 75.95,25.65 98.55,25.65 107.06,17.14 J1.107
CONT0_VCCIO  (via drill 0.3)
  Top 0.254: C55.1 10.56,39 11.18,39.62 11.9,39.62 U4.16 11.92,38.11 v11.94,38.1 | v16,45.21 16,43.73 U4.1
  Bottom 0.254: v11.94,38.1 11.94,42.93 12.7,43.69 15.96,43.69 U4.1 15.97,45.18 v16,45.21
CONT1_!RESET  (via drill 0.3)
  Top 0.203: J1.205 146.56,15.75 149.35,15.75 149.86,16.26 149.86,17.53 148.08,19.3 144.02,19.3 143,18.29 123.19,18.29 111.89,29.59 102.49,29.59 101.6,28.7 86.11,28.7 79.76,35.05 77.47,35.05 77.2,34.78 S18.9 77.22,34 77.22,34.8 77.34,34.92 v77.34,44.07 | S7.2 36.58,32 47.24,42.67 v47.24,45.34
  Bottom 0.203: v47.24,45.34 57.4,45.34 58.67,44.07 v77.34,44.07
CONT1_DBG_GPIO1  (via drill 0.3)
  Top 0.203: Q8.1 22.88,26.81 22.35,26.29 v22.35,23.62 | J1.201 136.4,9.53 133.35,6.48 103,6.48 96.01,13.46 51.56,13.46 51.05,12.95 49.91,12.95 v49.78,13.08
  Top 0.254: Q8.1 26.53,26.81 TP14.TESTPOINT
  Bottom 0.203: v22.35,23.62 22.35,20.95 24.77,18.54 34.8,18.54 37.85,15.49 42.42,15.49 42.67,15.75 48.77,15.75 49.78,14.73 v49.78,13.08
CONT1_DBG_GPIO2  (via drill 0.3)
  Top 0.203: J1.204 147.96,14.35 147.07,13.46 139.7,13.46 133.1,6.86 103.12,6.86 96.14,13.84 50.93,13.84 v50.67,13.59 | Q9.1 27.37,19.49 v27.43,19.43
  Top 0.254: TP15.TESTPOINT 26.27,20.46 Q9.1
  Bottom 0.203: v27.43,19.43 34.42,19.43 37.97,15.88 42.04,15.88 42.29,16.13 49.02,16.13 50.67,14.48 v50.67,13.59
CONT1_DBG_RX  (via drill 0.3)
  Top 0.203: U5.30 17.03,30.21 20.07,27.18 20.07,25.02 18.8,23.75 18.8,21.59 19.18,21.21 v19.18,20.95 | J1.203 146.3,12.06 147.57,13.34 148.72,13.34 149.61,12.45 149.61,8.64 148.84,7.87 136.02,7.87 133.86,5.71 102.74,5.71 95.76,12.7 52.32,12.7 51.56,11.94 48.26,11.94 v47.62,12.57
  Bottom 0.203: v19.18,20.95 19.3,20.95 24,16.26 34.04,16.26 37.08,13.21 41.53,13.21 41.78,12.95 47.37,12.95 47.62,12.7 v47.62,12.57
CONT1_DBG_TX  (via drill 0.3)
  Top 0.203: U5.2 15.47,32.28 14.99,32.77 14.99,34.04 15.24,34.29 17.53,34.29 20.45,31.37 20.45,24.89 19.18,23.62 19.18,22.23 v19.56,21.84 | J1.202 147.83,12.06 146.56,10.79 146.56,8.51 146.3,8.26 144.4,8.26 143.51,9.14 136.65,9.14 133.6,6.1 102.87,6.1 95.89,13.08 51.94,13.08 51.31,12.45 49.15,12.45 v48.26,13.34
  Bottom 0.203: v19.56,21.84 19.81,21.59 19.81,21.46 20.45,20.83 20.45,20.32 24.13,16.64 34.16,16.64 37.21,13.59 41.91,13.59 42.16,13.34 v48.26,13.34
CONT1_SWDCLK
  Top 0.203: S18.3 75.7,29.73 75.44,29.46 75.44,28.7 75.95,28.19 101.85,28.19 102.74,29.08 111.76,29.08 123.06,17.78 143.26,17.78 144.27,18.8 146.3,18.8 J1.206
CONT1_SWDIO
  Top 0.203: S18.2 75.2,29.99 74.93,29.72 74.93,28.7 75.95,27.69 102.11,27.69 103.12,28.7 111.51,28.7 123.06,17.14 J1.207
CONT1_VCCIO  (via drill 0.3)
  Top 0.254: C58.1 10.81,27.32 11.18,27.69 11.9,27.69 U5.16 11.92,26.18 v11.94,26.16 | v16,33.27 16,31.79 U5.1
  Bottom 0.254: v11.94,26.16 11.94,31.24 12.45,31.75 U5.1 15.97,33.25 v16,33.27
CONT_MOD0_IN  (via drill 0.3)
  Top 0.203: U17.2 35.69,130.17 38.73,127.13 v38.73,115.44 | J1.9 131.44,91.06 124.33,98.17 v119.51,98.17
  Bottom 0.203: v119.51,98.17 118.49,97.16 62.36,97.16 57.02,102.62 57.02,108.08 53.21,111.89 39.37,111.89 38.73,112.52 v38.73,115.44
CONT_MOD0_OUT  (via drill 0.3)
  Top 0.203: J1.10 132.72,81.92 132.72,91.06 124.59,99.19 118.75,99.19 | v41.4,115.44 41.4,118.87
  Top 0.254: U19.2 41.41,119 41.4,118.87 | 118.75,99.19 v118.62,99.31
  Bottom 0.203: v118.62,99.31 117.47,98.17 62.87,98.17 58.04,103 58.04,108.71 53.59,113.16 41.78,113.16 41.4,113.54 v41.4,115.44
CONT_MOD1_IN  (via drill 0.3)
  Top 0.203: J1.11 128.91,89.79 v121.54,97.16 | v121.54,109.22 121.54,118.49 124.33,121.28 124.33,127.38 119.38,132.33 U18.2
  Top 0.254: U18.2
  Bottom 0.203: v121.54,97.16 v121.54,109.22
CONT_MOD1_OUT  (via drill 0.3)
  Top 0.203: J1.12 128.91,80.77 127.76,81.92 127.76,89.79 v122.94,94.61 | v122.94,109.47 122.94,118.36 125.22,120.65 125.22,133.71 U20.2
  Bottom 0.203: v122.94,94.61 v122.94,109.47
CONT_MOD2_IN  (via drill 0.3, 0.41)
  Top 0.203: U16.39 21.36,5.74 v21.21,5.59 | v103,16 v105.54,16
  Bottom 0.203: v21.21,5.59 21.72,5.59 23.75,3.56 39.12,3.56 40.13,2.54 75.82,2.54 82.3,9.02 100.58,9.02 102.74,11.18 102.74,15.75 v103,16 | v105.54,16 106.93,16 110.62,19.68 139.45,19.68 145.54,25.78 145.54,71.63 140.59,76.58 127,76.58 125.22,78.36 125.22,82.04 J1.13
CONT_MOD2_OUT  (via drill 0.3, 0.41)
  Top 0.203: U16.38 20.86,6.39 v20.07,5.59 | v103.63,14.35 v105.92,14.35
  Bottom 0.203: v20.07,5.59 20.07,5.33 20.57,4.83 21.59,4.83 23.37,3.05 38.99,3.05 39.88,2.16 76.07,2.16 82.55,8.64 101.73,8.64 103.63,10.54 v103.63,14.35 | v105.92,14.35 110.74,19.18 139.57,19.18 146.05,25.65 146.05,71.75 140.72,77.09 127.76,77.09 126.36,78.49 J1.14
CONT_USB+
  Top 0.203: U23.2 87.56,63.45 87.12,63.88 87.12,65.02 87.88,65.79 90.81,65.79 92.58,64.01 92.58,55.37 94.23,53.72 94.23,33.78 96.65,31.37 115.19,31.37 120.4,26.16 126.49,26.16 J1.27
CONT_USB-
  Top 0.203: U23.6 87.5,61.48 87.5,59.82 88.88,58.44 arc-90 88.88,58.03 88.85,58 arc90 88.85,57.58 88.88,57.55 arc90 89.3,57.55 89.77,58.02 arc-90 90.18,58.02 90.21,58 arc-90 90.21,57.58 89.74,57.11 arc90 89.74,56.7 89.77,56.67 arc90 90.18,56.67 90.65,57.14 arc-90 91.06,57.14 91.09,57.11 arc-90 91.09,56.7 90.62,56.23 arc90 90.62,55.81 90.65,55.78 arc90 91.06,55.78 91.54,56.26 arc-90 91.95,56.26 91.98,56.23 arc-90 91.98,55.81 91.51,55.34 arc90 91.51,54.93 91.54,54.9 arc90 91.95,54.9 91.98,54.93 arc-90 92.39,54.93 93.85,53.47 93.85,33.53 96.39,30.99 115.06,30.99 120.27,25.78 122.43,25.78 124.71,23.5 126.36,23.5 J1.28
CONTROLLER_BUCK/LDO_N
  Top 0.203: U16.3 27.91,8.92 29.46,7.37 33.78,7.37 34.04,7.11 R1.2 R71.1
CONTROLLER_XIN
  Top 0.203: C1.1 28.05,3.52 X1.3
  Top 0.254: U16.1 26.61,4.12 27.18,3.56 28.02,3.56 X1.3 27.82,3.29
CONTROLLER_XOUT
  Top 0.254: U16.2 27.4,8.42 29.97,5.84 29.97,5.18 | C2.1 29.98,5.19 29.97,5.18 | 29.97,5.18 X1.1
GND  (via drill 0.3, 0.6, 0.61, 2.95 pad 5.08)
  Top 0.203: U21.10 79.1,105.77 | U21.4 v83.06,106.17 v84.33,106.17 85.09,106.17 85.16,106.1 D8.3 | U22.4 v95,106.68 | D8.5 92.05,104.8 | 92.05,104.8 v92.71,104.14 | 92.05,104.8 92.05,104.75 v91.44,104.14 | U22.10 99.21,107.08 99.31,107.19 v99.31,107.95 | U6.4 49.42,133.71 v49.78,133.35 | v67.31,62.99 67.56,62.99 68.07,63.5 U24.43 | C65.2 139.08,131.43 v139.06,131.32 | v136.27,135 S13.PAD 137.16,135.25 S13.2 | U14.17 131.45,124.21 131.32,124.08 v130.18,124.08 | C30.2 v129.03,122.81 | U14.1 134.76,125.62 v135,125.86 134.74,126.12 U14.2 | R96.1 119.9,122.29 v119.89,122.3 | U19.4 42.41,133.11 v42.42,133.1 | U19.5 42.41,138.54 v42.42,138.56 | C26.2 38.47,138.8 v38.48,138.81 | C22.2 v39.37,131.83 | U17.4 36.69,133.36 v36.96,133.1 | C16.2 45.48,133.34 v45.47,133.35 | C39.2 45.2,137.53 v45.21,137.54 | C18.2 v52.58,139.45 | v53.72,136.53 S12.PAD 54.99,136.78 S12.2 | C64.2 56.28,134.86 v56.26,134.87 | R91.1 58.31,137.81 v58.42,137.92 | C20.2 v33.53,135.64 | C24.2 32.24,138.54 v32.26,138.56 | S9.2 v34.29,124.08 | C33.2 v32,124.08 | S1.PAD 25.27,125.22 v25.15,125.35 | S1.1 25.22,123.25 v25.15,123.32 | C35.2 v25.02,121.28 | v23.24,129.41 23.09,129.51 C68.2 23.09,133.76 v23.24,133.86 | C31.2 24.13,135.38 v24,135.25
  Top 0.254: 79.1,105.77 78.6,105.27 C37.1 76.85,105.27 v76.45,105.66 v76.45,106.93 | D8.1 86.25,108.06 | 86.25,108.06 v85.6,108.71 | 86.25,108.06 86.47,108.06 v87.12,108.71 | D8.7 93.66,106.75 v93.73,106.68 v95,106.68 | v99.31,107.95 99.46,108.09 C38.1 101.49,108.09 v101.73,108.2 | C25.2 116.19,138.32 v116.08,138.43 | C23.2 v122.94,131.06 | C27.2 122.03,137.81 v121.92,137.92 | U18.4 121.39,133.83 v121.41,133.86 | U20.4 126.23,132.6 v126.24,132.59 | U20.5 126.23,138.16 v126.24,138.18 | C19.2 136.38,139.46 v136.4,139.45 | R73.1 v83.57,102.36 | R74.1 v83.57,109.98 | R76.1 v94.49,102.87 | R75.1 v94.49,110.49 | C4.1 65.15,59.69 v64.26,58.8 | U24.48 71.61,64.28 v72.52,64.26 | U24.5 70.62,67.83 v70.61,67.82 | U24.10 70.64,70.33 v70.61,70.36 | U24.24 65.07,72.22 v65.66,71.63 | C9.2 59.62,74.88 v59.69,74.8 | C10.2 59.11,77.9 v59.69,78.49 | C5.2 68.27,80.08 v68.2,80.01 | C6.2 71.17,80.06 v71.12,80.01 | C7.2 72.72,80.08 v72.64,80.01 | C8.2 75.62,80.08 v75.69,80.01 | R92.1 52.21,136.29 v52.32,136.4 | C66.1 v77.47,70.87 | C28.1 76.09,68.72 76.45,69.09 v77.47,69.09 | v106.17,130.56 106.15,130.58 C69.2 106.15,135.1 v106.17,135.13 | S10.2 117.86,125.09 v117.35,125.6 | C34.2 v115.32,125.6 | C21.2 117.74,135.02 v118.11,135.38 | U24.43 | C3.1 72.39,60.2 73.03,59.56 v73.03,58.93 | R14.2 v97.54,111.51 | R15.2 v97.54,101.35 | C32.2 108.57,138.03 v108.71,138.18 | C11.2 23.11,76.07 25.16,74.03 C63.2 | C40.2 128.27,135.4 v128.27,136.65 | C17.2 129.4,132.46 v128.27,132.46 | U7.4 133.25,132.84 v133.35,132.84 | R95.1 135,134.13 v135,135.13 | R94.1 140.21,135.02 v140.21,136.14 | C36.2 v108.58,122.3 | S2.1 108.9,124.14 v108.84,124.08 | S2.PAD v108.84,126.11 | U13.2 51.57,124.72 v51.82,124.97
  Top 0.254: U13.3 51.56,125.22 v51.82,124.97 | U13.1 51.58,124.22 51.82,124.46 v51.82,124.97 | C29.2 46.1,121.28 v45.97,121.16 | U13.17 48.27,122.82 48.01,122.56 v46.61,122.56 | R93.1 36.21,120.79 v36.45,121.03
  Top 0.305: R13.2 v80.77,111.51 | R12.2 v82.17,101.73
  Top 2.032: J10.20 72.64,11.05 82.17,11.05 88.14,5.08 v88.65,5.08
  Bottom 0.203: 172.47,59.69 173.35,58.8 173.23,58.8 172.72,59.31 | 172.59,48.39 172.72,48.26 | 172.59,50.04 172.72,49.91 | TP11.TESTPOINT 165.35,88.39 165.86,88.9 v172.72,88.9 | TP27.TESTPOINT 162.81,172.34 162.43,172.72
  Bottom 0.254: TP54.TESTPOINT 14.99,172.72
  Bottom 1.016: 57.15,118.36 57.15,115.57 J3.MNT3 | J2.MNT4 102.74,104.14 | 172.72,81.79 172.72,82.68 172.34,83.06 | 151.26,83.06 J1.MNT2 | 151.13,104.01 J2.MNT3
  Bottom 2.032: v88.65,5.08 105.92,5.08 | v172.72,5.08 154.81,5.08
  Bottom 2.54: J2.MNT2 150.75,162.94 150.75,167.39 156.08,172.72 162.43,172.72 v172.72,172.72 172.72,120.9 | J2.MNT1 109.22,169.04 105.54,172.72 v88.9,172.72 70.99,172.72 68.58,170.31 J3.MNT2 | v5.08,172.72 14.99,172.72 19.43,172.72 26.67,165.48 J3.MNT1 | 172.72,104.14 v172.72,88.9 172.72,81.79 172.72,59.31 172.72,49.91 172.72,48.26 v172.72,5.08 | 172.72,104.14 172.72,120.9 | 172.72,120.9 141.1,120.9 | J3.MNT4 v26.67,93.34 | J1.MNT2 151.13,104.01 | J2.MNT3 172.72,104.14
  other vias: 20.83,12.95 25.4,12.95 24.13,12.95 22.35,12.95 20.83,11.43 25.4,11.43 24.13,11.43 22.35,11.43 20.83,9.91 25.4,9.91 24.13,9.91 22.35,9.91 20.83,8.38 25.4,8.38 24.13,8.38 22.35,8.38 32.51,71.37 29.97,72.64 19.3,87.12 30.23,80.01 18.29,11.18 17.27,6.1 5.08,5.08 5.08,88.9 77.34,26.92 79.38,31.37 131.95,126.62 48.77,125.22 8.26,61.85 8,49.91 8.13,38.35 8.26,25.91 8.64,11.56 88.9,60.71 30.23,87.25 36.7,88.77 39.37,91.57 25.53,89.92 20.57,17.65 26.29,72.39 39.88,79.88 46.23,79.12 81.92,26.92 60.96,30.61 67.69,30.48 61.21,28.07 62.48,32.26 52.58,28.57 37.59,46.48 32.64,45.47 42.04,43.05 38.61,59.18 38.61,57.4 32.77,59.56 34.54,57.15 57.02,68.2 61.47,71.75 84.84,62.74 34.67,162.56 34.04,161.93 33.4,161.29 32.77,160.66 32.13,160.02 31.5,159.38 30.86,158.75 30.23,158.12 75.18,92.96 75.18,91.57 73.15,92.96 73.15,91.57 68.71,93.09 68.58,91.44 70.61,91.44 70.61,93.09 86.74,101.35 89.15,101.35 92.46,101.35
  pour Bottom (isolate 0.254, rank 4): 103,119.63 141.1,119.63 141.1,140.34 103,140.21
  pour Top (isolate 0.203, rank 2, no thermals): 0,93.73 0,0 95.25,0 95.25,93.73 75.95,93.73 75.95,96.77 68.45,96.77 68.45,93.73
  pour Bottom (isolate 0.305, rank 2): 0,0 0,93.73 68.45,93.73 68.45,96.77 75.95,96.77 75.95,93.73 95.25,93.73 95.25,0
  pour Bottom (isolate 0.305, rank 2): 105.41,77.98 105.41,87 154.94,87 154.94,77.98
  pour Top (isolate 0.305, rank 2): 93.09,152.53 93.22,166.37 154.94,166.37 154.69,152.53
  pour Bottom (isolate 0.102, rank 2): 22.86,100.33 22.86,107.95 73.28,108.08 73.28,112.52 103.5,112.52 103.5,100.46
  pour Bottom (isolate 0.254, rank 4): 21.72,118.24 58.93,118.24 58.93,140.84 21.72,140.72
  pour Bottom (isolate 0.305, rank 2): 105.41,100.46 105.41,112.39 154.94,112.39 154.94,100.46
  pour Bottom (isolate 0.305, rank 2): 105.41,4.57 105.41,29.46 154.94,29.46 155.07,4.57
  pour Top (isolate 0.305, rank 2): 105.41,4.57 105.41,29.46 154.94,29.46 155.07,4.57
  pour Bottom (isolate 0.305, rank 2): 93.09,152.53 93.22,166.37 154.94,166.37 154.69,152.53
  pour Top (isolate 0.305, rank 2): 22.86,152.02 22.86,166.37 84.45,166.37 84.33,152.02
  pour Bottom (isolate 0.305, rank 2): 22.86,152.02 22.86,166.37 84.45,166.37 84.33,152.02
HUB_!OVRCUR1  (via drill 0.3)
  Top 0.203: U24.12 72.85,71.33 78.23,76.71 79.25,76.71 | 79.25,76.71 v87.25,76.71 | v105.16,94.36 120.02,108.97 120.02,118.62 122.3,120.9 122.3,125.48 120.65,127.13 113.79,127.13 113.67,127.25 113.67,128.25 R56.1 | TP33.TESTPOINT 67.31,49.91 69.6,52.2 76.45,52.2 v77.22,52.96 | v79.12,77.6 79.25,77.47 79.25,76.71
  Top 0.254: S2.5 113.47,128.09 R56.1
  Bottom 0.203: v87.25,76.71 89.15,78.61 89.15,83.69 99.82,94.36 v105.16,94.36 | v77.22,52.96 77.22,56.9 79.25,58.93 79.25,77.47 v79.12,77.6
HUB_!OVRCUR2  (via drill 0.3)
  Top 0.203: S1.5 30.65,127.2 R55.1 30.59,113.17 33.91,109.86 61.85,109.86 64.01,107.7 v64.01,79.5 | v69.09,71.75 69.09,72.86 U24.16
  Bottom 0.203: v64.01,79.5 64.01,76.83 v69.09,71.75 69.09,69.6 66.29,66.8 66.29,61.98 70.87,57.4 TP35.TESTPOINT
HUB_!OVRCUR3  (via drill 0.3)
  Top 0.203: R72.1 67.06,72.89 U24.20 67.06,72.87 v67.06,70.23
  Bottom 0.203: TP37.TESTPOINT 75.06,49.53 76.45,48.13 76.45,45.47 75.56,44.58 66.29,44.58 65.15,45.72 65.15,66.93 65.66,67.44 65.66,68.83 v67.06,70.23
HUB_!OVRCUR4
  Top 0.203: U24.25 63.52,71.86 62.48,72.9 R67.1
HUB_!OVRCUR5
  Top 0.203: U24.29 57.03,69.33 R66.1
HUB_!OVRCUR6
  Top 0.203: U24.33 61.49,67.33 60.45,66.29 R68.1
HUB_!OVRCUR7
  Top 0.203: U24.37 61.74,64.28 60.71,63.25 57.29,63.25 R69.1
HUB_!PWRON1  (via drill 0.3)
  Top 0.203: U24.11 73.12,70.83 78.23,75.95 79.88,75.95 | 79.88,75.95 v87.63,75.95 | v105.03,93.34 120.52,108.84 120.52,118.49 122.81,120.78 122.81,125.73 120.9,127.64 118.75,127.64 v118.49,127.89 | v118.49,126.36 118.49,124.54 S10.1 | TP32.TESTPOINT 68.07,46.48 69.22,47.62 69.22,50.8 69.98,51.56 77.47,51.56 v78.11,52.2 | v80.01,73.66 80.01,75.82 79.88,75.95
  Bottom 0.203: v87.63,75.95 89.66,77.98 89.66,83.44 99.57,93.34 v105.03,93.34 | v118.49,127.89 v118.49,126.36 | v78.11,52.2 78.11,56.77 80.01,58.67 v80.01,73.66
HUB_!PWRON2  (via drill 0.3)
  Top 0.203: S9.1 34.94,124.83 34.54,125.22 31.5,125.22 30.99,124.71 30.99,113.28 34.04,110.24 62.1,110.24 64.52,107.82 64.52,80.26 v64.77,80.01 | v69.98,71.75 69.6,72.14 69.6,72.85 U24.15
  Bottom 0.203: v64.77,80.01 64.77,76.96 v69.98,71.75 69.98,69.98 66.67,66.67 66.67,62.1 72.39,56.39 72.39,47.62 71.25,46.48 TP34.TESTPOINT
HUB_!PWRON3  (via drill 0.3)
  Top 0.203: v67.94,69.72 67.94,71.12 67.56,71.5 U24.19
  Bottom 0.203: TP36.TESTPOINT 74.42,45.72 73.66,44.96 66.55,44.96 65.53,45.97 65.53,66.67 67.44,68.58 67.44,69.22 v67.94,69.72
HUB_CFG  (via drill 0.3)
  Top 0.203: 66.55,64.3 66.55,65.79 68.2,67.44 v68.58,67.44 | 75.18,61.59 80.9,61.59 82.3,60.2 TP28.TESTPOINT
  Top 0.254: U24.40 66.55,64.3 | v75.06,61.47 75.18,61.59
  Bottom 0.203: v68.58,67.44 68.96,67.06 69.6,67.06 70.36,66.29 70.36,65.02
  Bottom 0.254: 70.36,65.02 74.17,61.21 74.8,61.21 v75.06,61.47
HUB_DM1
  Top 0.203: U24.13 70.57,73.62 74.68,77.72 74.68,80.95 C8.1
  Top 0.254: R9.2 74.75,81.79 C8.1 | U24.13
HUB_DM2
  Top 0.203: U24.17 68.57,76.44 70.36,78.23 70.36,80.97 C6.1
  Top 0.254: R7.2 70.23,81.1 C6.1
HUB_DM3
  Top 0.203: U24.21 66.57,74.15 63.68,77.04 C10.1
  Top 0.254: C10.1 57.66,77.04 R11.2
HUB_DM4
  Top 0.203: U24.26 59.36,70.83 R82.1
HUB_DM5
  Top 0.203: U24.30 59.83,68.83 R80.1
  Top 0.254: U24.30
HUB_DM6
  Top 0.203: U24.34 62,66.83 60.45,65.28 57.29,65.28 R84.1
HUB_DM7
  Top 0.203: U24.38 65.57,63.79 65.28,63.5 61.98,63.5 60.71,62.23 R86.1
HUB_DP1
  Top 0.203: U24.14 70.07,73.88 73.91,77.72 73.91,78.99 73.53,79.38 73.53,80.97 C7.1
  Top 0.254: R8.2 73.58,81.79 C7.1 | U24.14 70.08,72.89
HUB_DP2
  Top 0.203: U24.18 68.07,76.7 69.72,78.36 69.72,79.12 69.09,79.76 69.09,80.97 C5.1
  Top 0.254: R6.2 69.22,81.1 C5.1
HUB_DP3
  Top 0.203: U24.22 66.07,73.76 64.08,75.74 63.28,75.74 arc-90 62.99,76.04 62.99,76.33 arc90 62.7,76.63 60.4,76.63 arc90 60.11,76.33 60.11,76.04 arc-90 59.82,75.74 C9.1
  Top 0.254: C9.1 57.91,75.74 R10.2
HUB_DP4
  Top 0.203: U24.27 60.93,70.33 60.45,69.85 57.29,69.85 R81.1
HUB_DP5
  Top 0.203: U24.31 61.47,68.33 60.45,67.31 56.53,67.31 R79.1
  Top 0.254: U24.31
HUB_DP6
  Top 0.203: U24.35 62.52,66.33 60.45,64.26 R83.1
HUB_DP7
  Top 0.203: R85.1 65.28,61.98 66.04,62.74 66.04,64.25 U24.39
HUB_PORTDIS  (via drill 0.3)
  Top 0.203: U24.42 67.57,64.77 v68.33,65.53 | v76.83,59.82 77.6,59.82 79.12,58.29 TP30.TESTPOINT
  Bottom 0.254: v68.33,65.53 73.79,59.82 v76.83,59.82
HUB_PORTPWR  (via drill 0.3)
  Top 0.203: U24.41 67.07,65.54 68.07,66.55 68.83,66.55 v69.47,66.04 | v75.95,60.71 79.38,60.71 80.9,59.18 80.9,48.13 TP29.TESTPOINT
  Bottom 0.254: v69.47,66.04 69.47,65.15 73.91,60.45 75.69,60.45 v75.95,60.71
JTAG_!RESET  (via drill 0.3)
  Top 0.203: v47.5,30.48 47.24,30.73 47.24,34.29 v47.5,34.54 | v54.1,33.02 53.05,33.02 S14.8 | v60.71,33.02 S15.8 | v67.31,33.02 66.25,33.02 S16.8 | v73.28,33.02 S17.8 | v78.99,33.02 77.94,33.02 S18.8
  Bottom 0.203: v47.5,30.48 50.72,27.25 S19.1 51.82,21.92 51.82,13.72 54.23,11.3 54.23,5.71 54.86,5.08 64.39,5.08 J10.15 | v47.5,34.54 47.5,35.05 48.26,35.81 53.59,35.81 | 53.59,35.81 54.1,35.31 v54.1,33.02 | 53.59,35.81 60.2,35.81 | 60.2,35.81 60.71,35.31 v60.71,33.02 | 60.2,35.81 67.06,35.81 | 67.06,35.81 67.31,35.56 v67.31,33.02 | 67.06,35.81 72.9,35.81 | 72.9,35.81 73.15,35.56 73.15,33.15 v73.28,33.02 | 72.9,35.81 78.49,35.81 78.99,35.31 v78.99,33.02
JTAG_SWDCLK  (via drill 0.3)
  Top 0.203: S14.4 51.31,29.46 51.56,29.21 v54.86,29.21 | S15.4 57.91,29.97 58.17,29.72 v58.17,29.21 v60.96,29.21 | v64.52,29.21 S16.4 | v59.18,22.1 v59.18,25.15
  Top 0.254: v64.52,29.21 v67.31,29.21 | S17.4 v70.61,29.21 v73.41,29.21 | v76.2,29.21 S18.4
  Bottom 0.203: v54.86,29.21 v58.17,29.21 59.18,27.94 v59.18,25.15 | v60.96,29.21 v64.52,29.21 | J10.9 59.18,8.13 v59.18,22.1
  Bottom 0.254: v67.31,29.21 v70.61,29.21 | v73.41,29.21 v76.2,29.21
JTAG_SWDIO  (via drill 0.3)
  Top 0.203: J10.7 56.77,7.75 v56.77,11.18 | S14.1 49.28,31.24 v49.28,29.72 47.75,31.24 47.75,33.27 v48.01,33.53 | 56.13,31.45 S15.1 56.17,31.5 v55.12,31.5 | S16.1 61.73,31.51 v61.72,31.5 | S17.1 68.08,31.51 v67.94,31.5
  Top 0.254: v73.53,31.5 74.46,31.5 S18.1
  Bottom 0.203: v56.77,11.18 53.21,14.73 S19.IN 53.21,25.78 v49.28,29.72 | v48.01,33.53 48.01,34.04 49.28,35.31 50.29,35.31 54.1,31.5 v55.12,31.5 55.12,34.8 55.63,35.31 57.15,35.31 60.96,31.5 v61.72,31.5 61.72,35.05 61.98,35.31 63.25,35.31 67.06,31.5 v67.94,31.5 68.07,31.62 68.07,34.8 68.58,35.31 69.72,35.31 v73.53,31.5
JTAG_VTREF  (via drill 0.3)